# Altium project ZynQ-Feather r0.2.PrjPCB (part 2 of 2)

## Sheet 10_DDR3 RAM.SchDoc
size A3; SheetNumber: 10; SheetTotal: 14
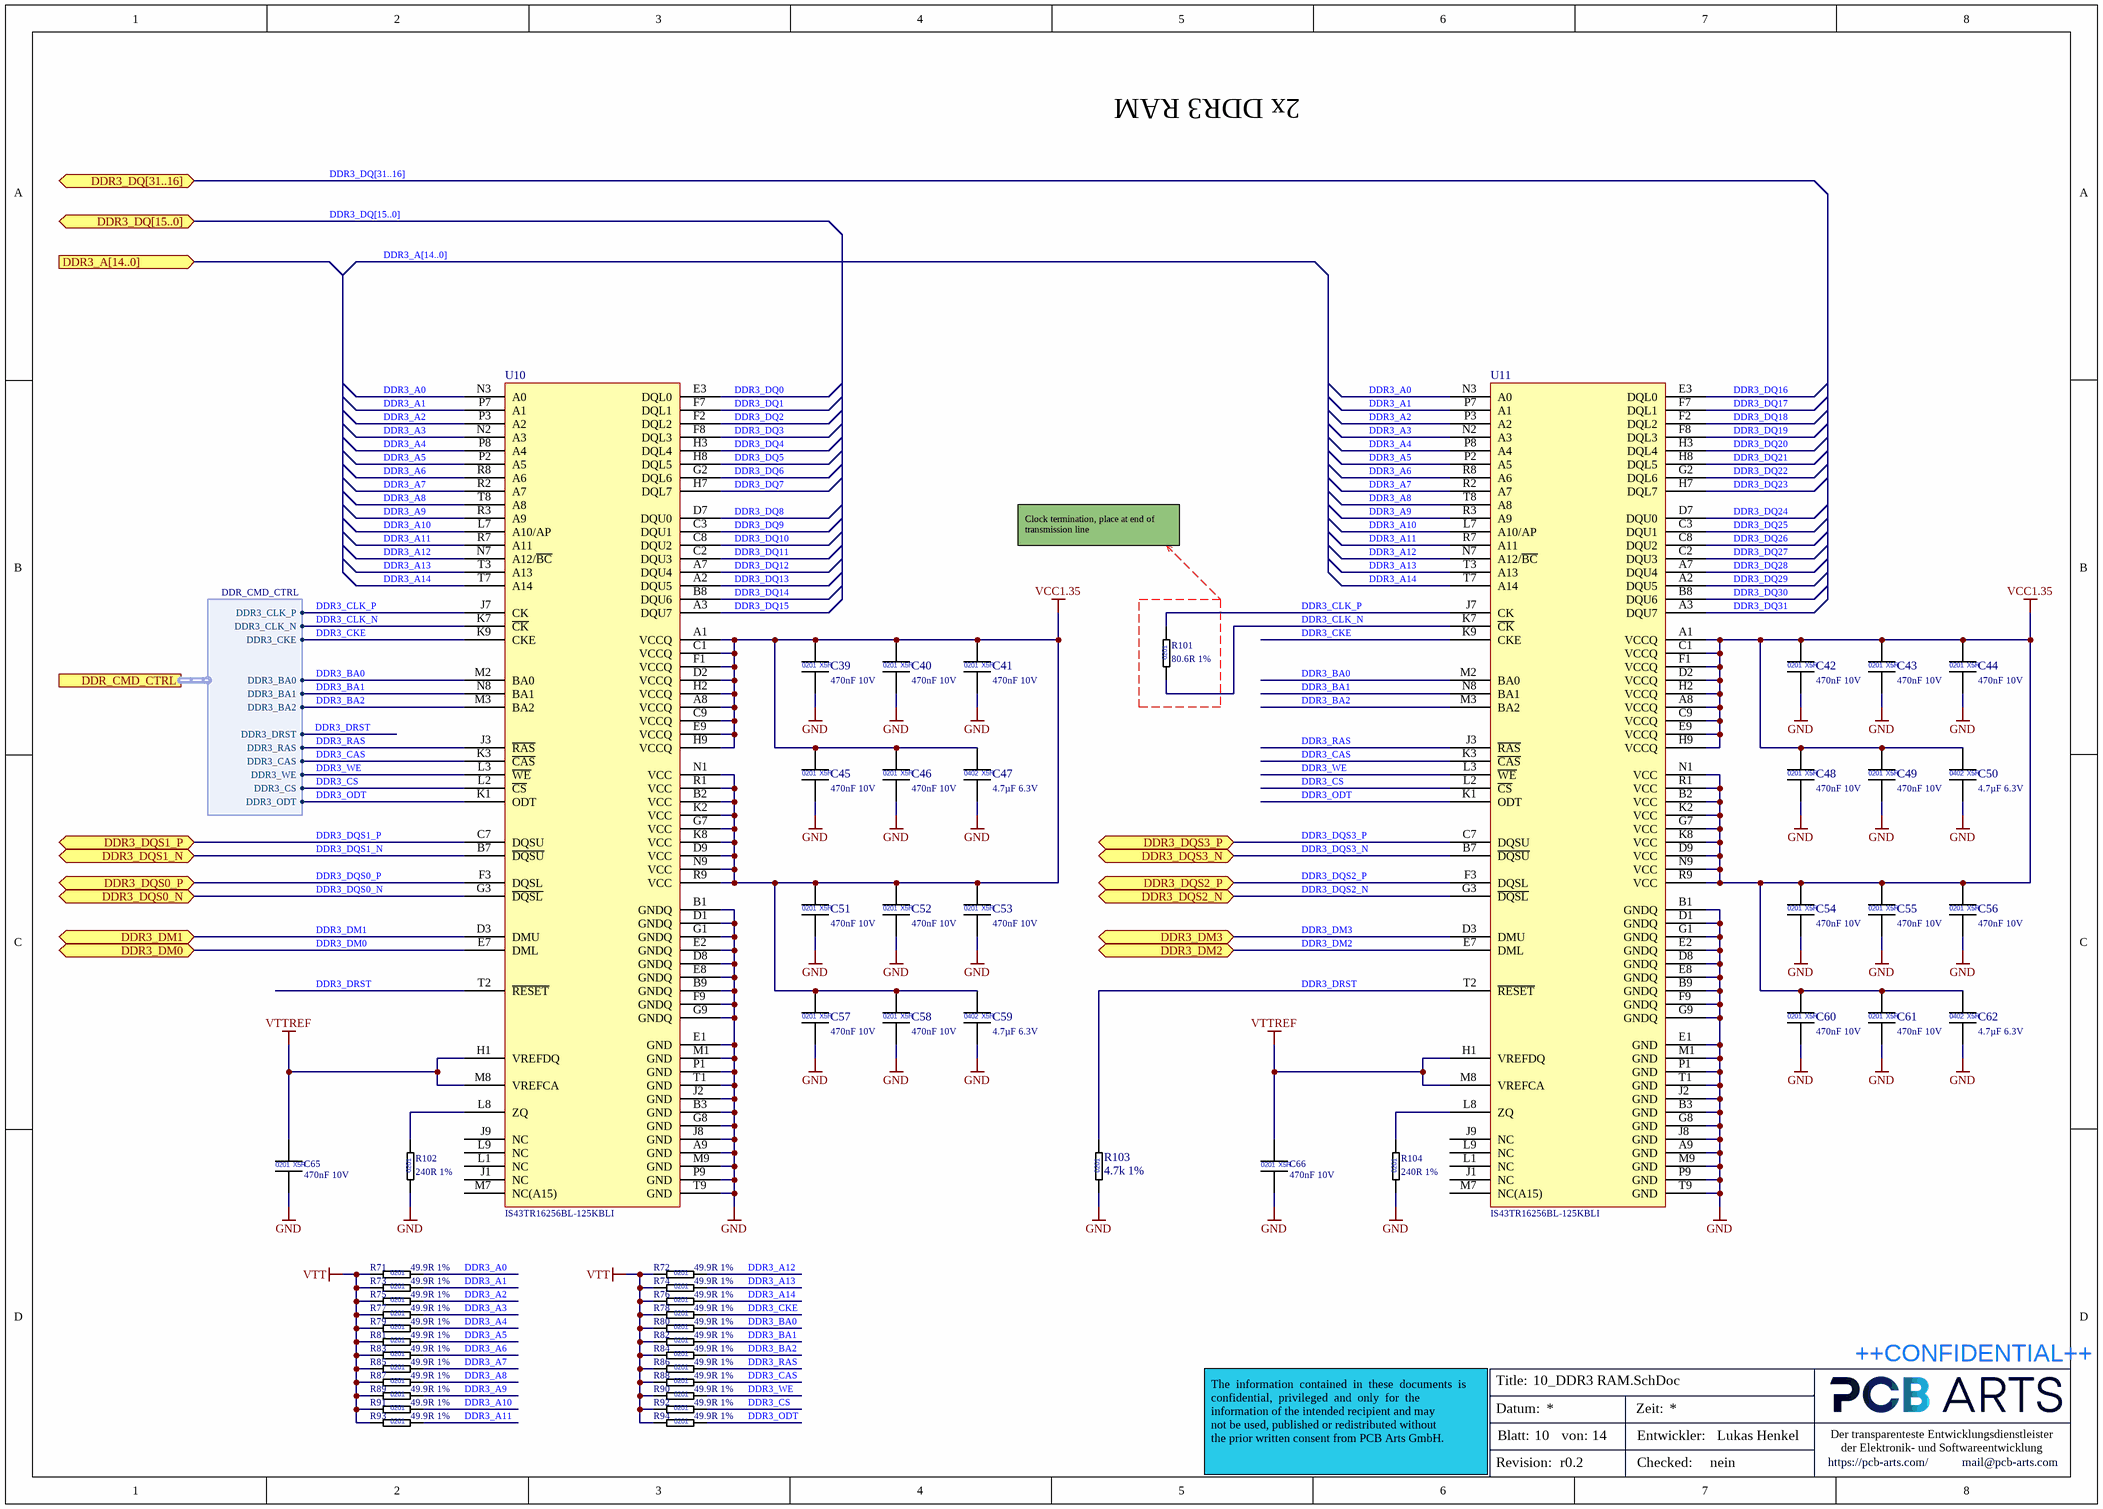
[diagram p10: 10_DDR3 RAM.SchDoc]

### Parts
C39  470nF 10V  [CAPC0603X03L]
C40  470nF 10V  [CAPC0603X03L]
C41  470nF 10V  [CAPC0603X03L]
C42  470nF 10V  [CAPC0603X03L]
C43  470nF 10V  [CAPC0603X03L]
C44  470nF 10V  [CAPC0603X03L]
C45  470nF 10V  [CAPC0603X03L]
C46  470nF 10V  [CAPC0603X03L]
C47  4.7µF 6.3V  [CAPC1005X06L]
C48  470nF 10V  [CAPC0603X03L]
C49  470nF 10V  [CAPC0603X03L]
C50  4.7µF 6.3V  [CAPC1005X06L]
C51  470nF 10V  [CAPC0603X03L]
C52  470nF 10V  [CAPC0603X03L]
C53  470nF 10V  [CAPC0603X03L]
C54  470nF 10V  [CAPC0603X03L]
C55  470nF 10V  [CAPC0603X03L]
C56  470nF 10V  [CAPC0603X03L]
C57  470nF 10V  [CAPC0603X03L]
C58  470nF 10V  [CAPC0603X03L]
C59  4.7µF 6.3V  [CAPC1005X06L]
C60  470nF 10V  [CAPC0603X03L]
C61  470nF 10V  [CAPC0603X03L]
C62  4.7µF 6.3V  [CAPC1005X06L]
C65  470nF 10V  [CAPC0603X03L]
C66  470nF 10V  [CAPC0603X03L]
R71  49.9R 1%  [RESC0603X03L]
R72  49.9R 1%  [RESC0603X03L]
R73  49.9R 1%  [RESC0603X03L]
R74  49.9R 1%  [RESC0603X03L]
R75  49.9R 1%  [RESC0603X03L]
R76  49.9R 1%  [RESC0603X03L]
R77  49.9R 1%  [RESC0603X03L]
R78  49.9R 1%  [RESC0603X03L]
R79  49.9R 1%  [RESC0603X03L]
R80  49.9R 1%  [RESC0603X03L]
R81  49.9R 1%  [RESC0603X03L]
R82  49.9R 1%  [RESC0603X03L]
R83  49.9R 1%  [RESC0603X03L]
R84  49.9R 1%  [RESC0603X03L]
R85  49.9R 1%  [RESC0603X03L]
R86  49.9R 1%  [RESC0603X03L]
R87  49.9R 1%  [RESC0603X03L]
R88  49.9R 1%  [RESC0603X03L]
R89  49.9R 1%  [RESC0603X03L]
R90  49.9R 1%  [RESC0603X03L]
R91  49.9R 1%  [RESC0603X03L]
R92  49.9R 1%  [RESC0603X03L]
R93  49.9R 1%  [RESC0603X03L]
R94  49.9R 1%  [RESC0603X03L]
R101  80.6R 1%  [RESC0603X03L]
R102  240R 1%  [RESC0603X03L]
R103  4.7k 1%  [RESC0603X03L]
R104  240R 1%  [RESC0603X03L]
U10  IS43TR16256BL-125KBLI  [BGA96C80P9X16_900X1300X120]
U11  IS43TR16256BL-125KBLI  [BGA96C80P9X16_900X1300X120]

### Ports
DDR3_A[14..0] (in), DDR3_DM0 (bidir), DDR3_DM1 (bidir), DDR3_DM2 (bidir), DDR3_DM3 (bidir), DDR3_DQ[15..0] (bidir), DDR3_DQ[31..16] (bidir), DDR3_DQS0_N (bidir), DDR3_DQS0_P (bidir), DDR3_DQS1_N (bidir), DDR3_DQS1_P (bidir), DDR3_DQS2_N (bidir), DDR3_DQS2_P (bidir), DDR3_DQS3_N (bidir), DDR3_DQS3_P (bidir), DDR_CMD_CTRL (harness DDR_CMD_CTRL)

### Harnesses
DDR_CMD_CTRL: DDR3_CLK_P, DDR3_CLK_N, DDR3_CKE, DDR3_BA0, DDR3_BA1, DDR3_RAS, DDR3_CS, DDR3_WE, DDR3_CAS, DDR3_BA2, DDR3_ODT, DDR3_DRST

### Nets
GND: C39.2 C40.2 C41.2 C42.2 C43.2 C44.2 C45.2 C46.2 C47.2 C48.2 C49.2 C50.2 C51.2 C52.2 C53.2 C54.2 C55.2 C56.2 C57.2 C58.2 C59.2 C60.2 C61.2 C62.2 C65.2 C66.2 R102.1 R103.1 R104.1 U10.A9(GND) U10.B1(GNDQ) U10.B3(GND) U10.B9(GNDQ) U10.D1(GNDQ) U10.D8(GNDQ) U10.E1(GND) U10.E2(GNDQ) U10.E8(GNDQ) U10.F9(GNDQ) U10.G1(GNDQ) U10.G8(GND) U10.G9(GNDQ) U10.J2(GND) U10.J8(GND) U10.M1(GND) U10.M9(GND) U10.P1(GND) U10.P9(GND) U10.T1(GND) U10.T9(GND) U11.A9(GND) U11.B1(GNDQ) U11.B3(GND) U11.B9(GNDQ) U11.D1(GNDQ) U11.D8(GNDQ) U11.E1(GND) U11.E2(GNDQ) U11.E8(GNDQ) U11.F9(GNDQ) U11.G1(GNDQ) U11.G8(GND) U11.G9(GNDQ) U11.J2(GND) U11.J8(GND) U11.M1(GND) U11.M9(GND) U11.P1(GND) U11.P9(GND) U11.T1(GND) U11.T9(GND)
VCC1.35: C39.1 C40.1 C41.1 C42.1 C43.1 C44.1 C45.1 C46.1 C47.1 C48.1 C49.1 C50.1 C51.1 C52.1 C53.1 C54.1 C55.1 C56.1 C57.1 C58.1 C59.1 C60.1 C61.1 C62.1 U10.A1(VCCQ) U10.A8(VCCQ) U10.B2(VCC) U10.C1(VCCQ) U10.C9(VCCQ) U10.D2(VCCQ) U10.D9(VCC) U10.E9(VCCQ) U10.F1(VCCQ) U10.G7(VCC) U10.H2(VCCQ) U10.H9(VCCQ) U10.K2(VCC) U10.K8(VCC) U10.N1(VCC) U10.N9(VCC) U10.R1(VCC) U10.R9(VCC) U11.A1(VCCQ) U11.A8(VCCQ) U11.B2(VCC) U11.C1(VCCQ) U11.C9(VCCQ) U11.D2(VCCQ) U11.D9(VCC) U11.E9(VCCQ) U11.F1(VCCQ) U11.G7(VCC) U11.H2(VCCQ) U11.H9(VCCQ) U11.K2(VCC) U11.K8(VCC) U11.N1(VCC) U11.N9(VCC) U11.R1(VCC) U11.R9(VCC)
VTT: R71.1 R72.1 R73.1 R74.1 R75.1 R76.1 R77.1 R78.1 R79.1 R80.1 R81.1 R82.1 R83.1 R84.1 R85.1 R86.1 R87.1 R88.1 R89.1 R90.1 R91.1 R92.1 R93.1 R94.1
VTTREF: C65.1 C66.1 U10.H1(VREFDQ) U10.M8(VREFCA) U11.H1(VREFDQ) U11.M8(VREFCA)
DDR3_A0: R71.2 U10.N3(A0) U11.N3(A0)
DDR3_A1: R73.2 U10.P7(A1) U11.P7(A1)
DDR3_A2: R75.2 U10.P3(A2) U11.P3(A2)
DDR3_A3: R77.2 U10.N2(A3) U11.N2(A3)
DDR3_A4: R79.2 U10.P8(A4) U11.P8(A4)
DDR3_A5: R81.2 U10.P2(A5) U11.P2(A5)
DDR3_A6: R83.2 U10.R8(A6) U11.R8(A6)
DDR3_A7: R85.2 U10.R2(A7) U11.R2(A7)
DDR3_A8: R87.2 U10.T8(A8) U11.T8(A8)
DDR3_A9: R89.2 U10.R3(A9) U11.R3(A9)
DDR3_A10: R91.2 U10.L7(A10/AP) U11.L7(A10/AP)
DDR3_A11: R93.2 U10.R7(A11) U11.R7(A11)
DDR3_A12: R72.2 U10.N7(A12/~{BC}) U11.N7(A12/~{BC})
DDR3_A13: R74.2 U10.T3(A13) U11.T3(A13)
DDR3_A14: R76.2 U10.T7(A14) U11.T7(A14)
DDR3_BA0: R80.2 U10.M2(BA0) U11.M2(BA0) ; port DDR_CMD_CTRL.DDR3_BA0
DDR3_BA1: R82.2 U10.N8(BA1) U11.N8(BA1) ; port DDR_CMD_CTRL.DDR3_BA1
DDR3_BA2: R84.2 U10.M3(BA2) U11.M3(BA2) ; port DDR_CMD_CTRL.DDR3_BA2
DDR3_CAS: R88.2 U10.K3(~{CAS}) U11.K3(~{CAS}) ; port DDR_CMD_CTRL.DDR3_CAS
DDR3_CKE: R78.2 U10.K9(CKE) U11.K9(CKE) ; port DDR_CMD_CTRL.DDR3_CKE
DDR3_CLK_N: R101.1 U10.K7(~{CK}) U11.K7(~{CK}) ; port DDR_CMD_CTRL.DDR3_CLK_N
DDR3_CLK_P: R101.2 U10.J7(CK) U11.J7(CK) ; port DDR_CMD_CTRL.DDR3_CLK_P
DDR3_CS: R92.2 U10.L2(~{CS}) U11.L2(~{CS}) ; port DDR_CMD_CTRL.DDR3_CS
DDR3_DM0: U10.E7(DML) ; port DDR3_DM0
DDR3_DM1: U10.D3(DMU) ; port DDR3_DM1
DDR3_DM2: U11.E7(DML) ; port DDR3_DM2
DDR3_DM3: U11.D3(DMU) ; port DDR3_DM3
DDR3_DQ0: U10.E3(DQL0)
DDR3_DQ1: U10.F7(DQL1)
DDR3_DQ2: U10.F2(DQL2)
DDR3_DQ3: U10.F8(DQL3)
DDR3_DQ4: U10.H3(DQL4)
DDR3_DQ5: U10.H8(DQL5)
DDR3_DQ6: U10.G2(DQL6)
DDR3_DQ7: U10.H7(DQL7)
DDR3_DQ8: U10.D7(DQU0)
DDR3_DQ9: U10.C3(DQU1)
DDR3_DQ10: U10.C8(DQU2)
DDR3_DQ11: U10.C2(DQU3)
DDR3_DQ12: U10.A7(DQU4)
DDR3_DQ13: U10.A2(DQU5)
DDR3_DQ14: U10.B8(DQU6)
DDR3_DQ15: U10.A3(DQU7)
DDR3_DQ16: U11.E3(DQL0)
DDR3_DQ17: U11.F7(DQL1)
DDR3_DQ18: U11.F2(DQL2)
DDR3_DQ19: U11.F8(DQL3)
DDR3_DQ20: U11.H3(DQL4)
DDR3_DQ21: U11.H8(DQL5)
DDR3_DQ22: U11.G2(DQL6)
DDR3_DQ23: U11.H7(DQL7)
DDR3_DQ24: U11.D7(DQU0)
DDR3_DQ25: U11.C3(DQU1)
DDR3_DQ26: U11.C8(DQU2)
DDR3_DQ27: U11.C2(DQU3)
DDR3_DQ28: U11.A7(DQU4)
DDR3_DQ29: U11.A2(DQU5)
DDR3_DQ30: U11.B8(DQU6)
DDR3_DQ31: U11.A3(DQU7)
DDR3_DQS0_N: U10.G3(~{DQSL}) ; port DDR3_DQS0_N
DDR3_DQS0_P: U10.F3(DQSL) ; port DDR3_DQS0_P
DDR3_DQS1_N: U10.B7(~{DQSU}) ; port DDR3_DQS1_N
DDR3_DQS1_P: U10.C7(DQSU) ; port DDR3_DQS1_P
DDR3_DQS2_N: U11.G3(~{DQSL}) ; port DDR3_DQS2_N
DDR3_DQS2_P: U11.F3(DQSL) ; port DDR3_DQS2_P
DDR3_DQS3_N: U11.B7(~{DQSU}) ; port DDR3_DQS3_N
DDR3_DQS3_P: U11.C7(DQSU) ; port DDR3_DQS3_P
DDR3_DRST: R103.2 U10.T2(~{RESET}) U11.T2(~{RESET}) ; port DDR_CMD_CTRL.DDR3_DRST
DDR3_ODT: R94.2 U10.K1(ODT) U11.K1(ODT) ; port DDR_CMD_CTRL.DDR3_ODT
DDR3_RAS: R86.2 U10.J3(~{RAS}) U11.J3(~{RAS}) ; port DDR_CMD_CTRL.DDR3_RAS
DDR3_WE: R90.2 U10.L3(~{WE}) U11.L3(~{WE}) ; port DDR_CMD_CTRL.DDR3_WE
NetR102_2: R102.2 U10.L8(ZQ)
NetR104_2: R104.2 U11.L8(ZQ)

Not connected (* = marked no-connect by the designer): U10 J1(NC) J9(NC) L1(NC) L9(NC) M7(NC(A15)); U11 J1(NC) J9(NC) L1(NC) L9(NC) M7(NC(A15))

### Buses and harness runs
bus DDR3_A[14..0] = port DDR3_A[14..0]
bus DDR3_DQ[15..0] = port DDR3_DQ[15..0]
bus DDR3_DQ[31..16] = port DDR3_DQ[31..16]

### Notes on the sheet
- 2x DDR3 RAM
- Clock termination, place at end of transmission line
- Title:
- ++CONFIDENTIAL++
- Datum:
- Blatt:
- von:
- Zeit:
- Entwickler:
- Der transparenteste Entwicklungsdienstleister
  der Elektronik- und Softwareentwicklung
- The  information  contained  in  these  documents  is  confidential,  privileged  and  only  for  the
  information of the intended recipient and may
  not be used, published or redistributed without
  the prior written consent from PCB Arts GmbH.
- Revision:
- Checked:
- https://pcb-arts.com/
- mail@pcb-arts.com
- (in symbol CAP_0201_470nF_10V) 0201; X5R
- (in symbol CAP_0402_4.7µ_6.3V) 0402; X5R
- (in symbol RES_0201_4.7k_1%) 0201
- (in symbol RES_0201_49.9R_1%) 0201
- (in symbol RES_0201_80.6R_1%) 0201
- (in symbol RES_0201_240R_1%) 0201

### Library data of the parts
C39-C46 C48 C49 C51-C58 C60 C61 C65 C66 = CAP_0201_470nF_10V: Multilayer Ceramic Capacitors MLCC - SMD/SMT 0201 10VDC; Manufacturer 1: Taiyo Yuden; Manufacturer 1 Prt. Nr.: LMK063BBJ474KPLF; Manufacturer 2 Prt. Nr.: C0603X5R1A474M030BC; Manufacturer 2: TDK
C47 C50 C59 C62 = CAP_0402_4.7µ_6.3V: Multilayer Ceramic Capacitors MLCC - SMD/SMT 0402 6.3VDC; Manufacturer 1: Murata Electronics; Manufacturer 1 Prt. Nr.: GRM155R60J475ME47D; Manufacturer 2 Prt. Nr.: JMK105BC6475MV-F; Manufacturer 2: Taiyo Yuden
R71-R94 = RES_0201_49.9R_1%: Thick Film Resistors - SMD 49.9R OHM 1%; Manufacturer 1: Yageo; Manufacturer 1 Prt. Nr.: AC0201FR-0749R9L; Manufacturer 2 Prt. Nr.: CRCW020149R9FNED; Manufacturer 2: Vishay / Dale
R101 = RES_0201_80.6R_1%: Thick Film Resistors - SMD 80.6R OHM 1%; Manufacturer 1: Yageo; Manufacturer 1 Prt. Nr.: RC0201FR-0780R6L; Manufacturer 2 Prt. Nr.: CRCW020180R6FKED; Manufacturer 2: Vishay / Dale
R102 R104 = RES_0201_240R_1%: Thick Film Resistors - SMD 240 OHM 1%; Manufacturer 1: Yageo; Manufacturer 1 Prt. Nr.: RC0201FR-07240RL; Manufacturer 2 Prt. Nr.: CRCW0201240RFNED; Manufacturer 2: Vishay / Dale
R103 = RES_0201_4.7k_1%: Thick Film Resistors - SMD 4.7K OHM 1%; Manufacturer 1: Yageo; Manufacturer 1 Prt. Nr.: RC0201JR-074K7P; Manufacturer 2 Prt. Nr.: CRCW02014K70FNED; Manufacturer 2: Vishay / Dale
U10 U11 = IS43TR16256BL-125KBLI_DRAM 4G, 1.35V, DDR3L, 256Mx16: DRAM 4G, 1.35V, DDR3L, 256Mx16, 1600MT/s @ 11-11-11, 96 ball BGA (9mm x13mm) RoHS, IT; Manufacturer 1: ISSI; Manufacturer 1 Prt. Nr.: IS43TR16256BL-125KBLI

## Sheet 12_QSPI SD-Card.SchDoc
size A4; SheetNumber: 12; SheetTotal: 14
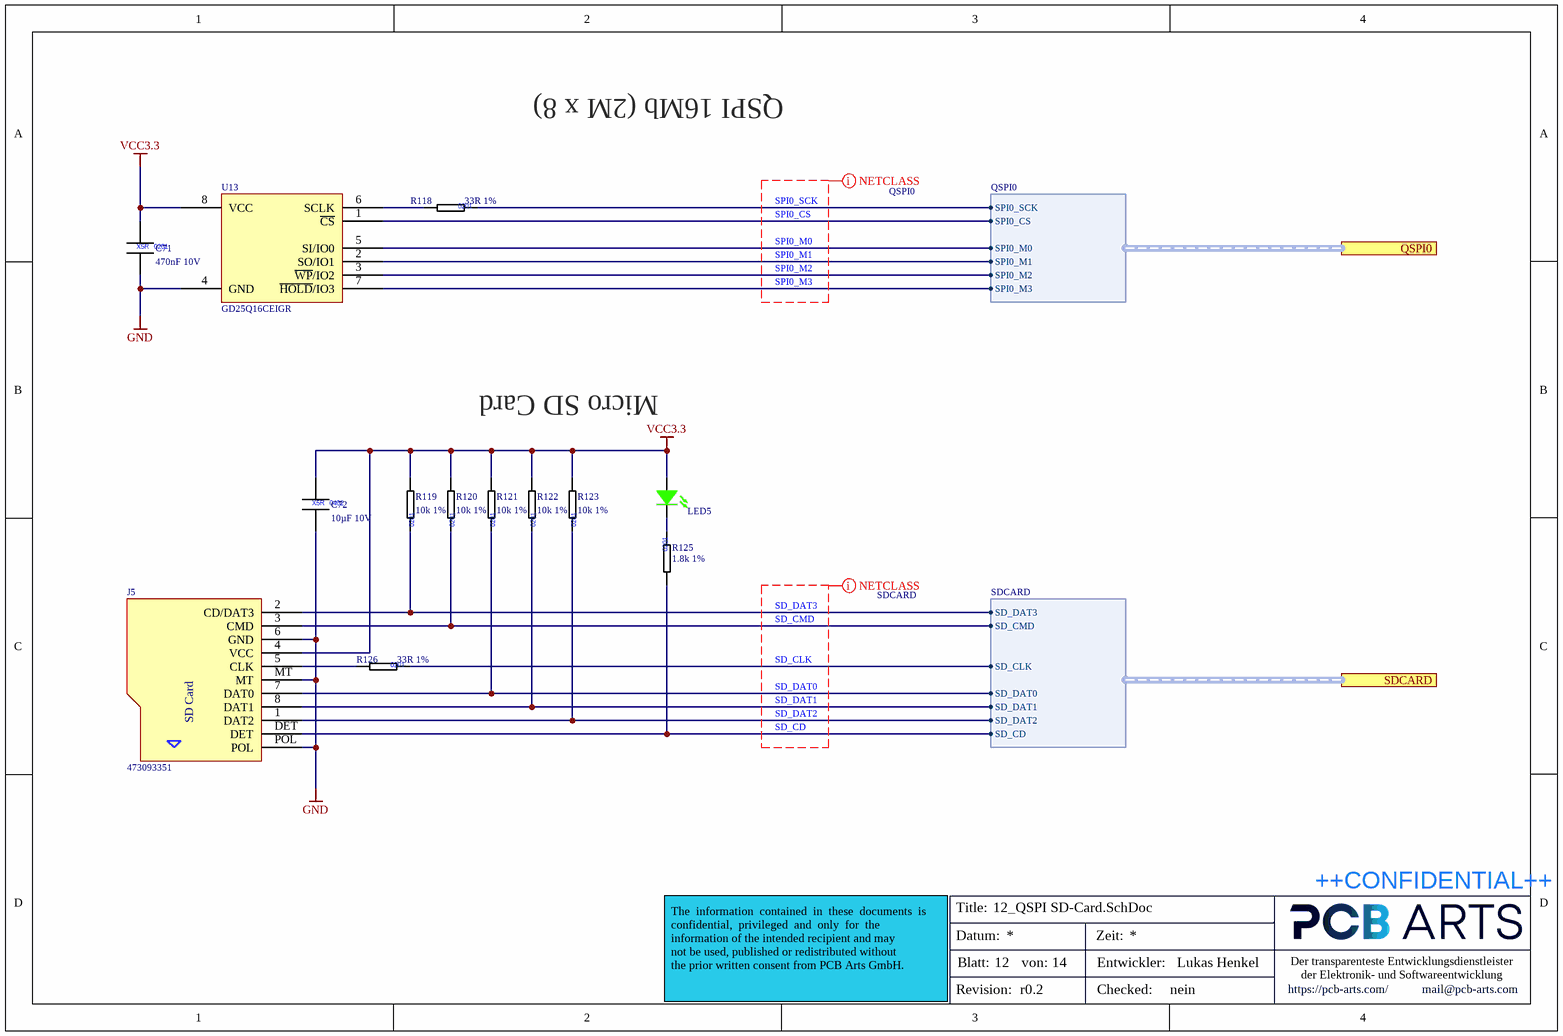
[diagram p11: 12_QSPI SD-Card.SchDoc]

### Parts
C71  470nF 10V  [CAPC0603X03L]
C72  10µF 10V  [CAPC1005X06L]
J5  473093351  [47309-3351]
LED5  150040GS73220  [WL-SMCC_0402_H=0.25mm]  (value not drawn)
R118  33R 1%  [RESC0603X03L]
R119  10k 1%  [RESC0603X03L]
R120  10k 1%  [RESC0603X03L]
R121  10k 1%  [RESC0603X03L]
R122  10k 1%  [RESC0603X03L]
R123  10k 1%  [RESC0603X03L]
R125  1.8k 1%  [RESC0603X03L]
R126  33R 1%  [RESC0603X03L]
U13  GD25Q16CEIGR  [PSON50P300X50_HS-9N]

### Ports
QSPI0 (harness QSPI0), SDCARD (harness SDCARD)

### Harnesses
QSPI0: SPI0_SCK, SPI0_CS, SPI0_M0, SPI0_M1, SPI0_M2, SPI0_M3
SDCARD: SD_DAT3, SD_CMD, SD_CLK, SD_DAT0, SD_DAT1, SD_DAT2, SD_CD

### Nets
GND: C71.2 C72.2 J5.6(GND) J5.MT J5.POL U13.4(GND)
VCC3.3: C71.1 C72.1 J5.4(VCC) LED5.2 R119.2 R120.2 R121.2 R122.2 R123.2 U13.8(VCC)
SD_CD: J5.DET R125.2 ; port SDCARD.SD_CD
SD_CLK: R126.1 ; port SDCARD.SD_CLK
SD_CMD: J5.3(CMD) R120.1 ; port SDCARD.SD_CMD
SD_DAT0: J5.7(DAT0) R121.1 ; port SDCARD.SD_DAT0
SD_DAT1: J5.8(DAT1) R122.1 ; port SDCARD.SD_DAT1
SD_DAT2: J5.1(DAT2) R123.1 ; port SDCARD.SD_DAT2
SD_DAT3: J5.2(CD/DAT3) R119.1 ; port SDCARD.SD_DAT3
SPI0_CS: U13.1(~{CS}) ; port QSPI0.SPI0_CS
SPI0_M0: U13.5(SI/IO0) ; port QSPI0.SPI0_M0
SPI0_M1: U13.2(SO/IO1) ; port QSPI0.SPI0_M1
SPI0_M2: U13.3(~{WP}/IO2) ; port QSPI0.SPI0_M2
SPI0_M3: U13.7(~{HOLD}/IO3) ; port QSPI0.SPI0_M3
SPI0_SCK: R118.1 ; port QSPI0.SPI0_SCK
NetJ5_5: J5.5(CLK) R126.2
NetLED5_1: LED5.1 R125.1
NetR118_2: R118.2 U13.6(SCLK)

### Layout directives
net class QSPI0: SPI0_CS, SPI0_M0, SPI0_M1, SPI0_M2, SPI0_M3, SPI0_SCK
net class SDCARD: SD_CD, SD_CLK, SD_CMD, SD_DAT0, SD_DAT1, SD_DAT2, SD_DAT3

### Notes on the sheet
- QSPI 16Mb (2M x 8)
- Micro SD Card
- Title:
- ++CONFIDENTIAL++
- Datum:
- Blatt:
- von:
- Zeit:
- Entwickler:
- Der transparenteste Entwicklungsdienstleister
  der Elektronik- und Softwareentwicklung
- The  information  contained  in  these  documents  is  confidential,  privileged  and  only  for  the
  information of the intended recipient and may
  not be used, published or redistributed without
  the prior written consent from PCB Arts GmbH.
- Revision:
- Checked:
- https://pcb-arts.com/
- mail@pcb-arts.com
- (in symbol 473093351_1.10mm Pitch microSD Card Header) SD Card
- (in symbol CAP_0201_470nF_10V) X5R; 0201
- (in symbol CAP_0402_10µ_10V) X5R; 0402
- (in symbol RES_0201_1.8k_1%) 0201
- (in symbol RES_0201_10k_1%) 0201
- (in symbol RES_0201_33R_1%) 0201

### Library data of the parts
C71 = CAP_0201_470nF_10V: as C39-C46 on sheet 10_DDR3 RAM; Manufacturer 2: TDK
C72 = CAP_0402_10µ_10V: Multilayer Ceramic Capacitors MLCC - SMD/SMT 0402 10VDC; Manufacturer 1: Murata Electronics; Manufacturer 1 Prt. Nr.: GRM155R61A475MEAAD; Manufacturer 2 Prt. Nr.: LMK105BBJ475MVLF; Manufacturer 2: Taiyo Yuden
J5 = 473093351_1.10mm Pitch microSD Card Header: 1.10mm Pitch microSD Card Header with Detect Switch, Height 3.35mm, Lead-Free; Manufacturer 1: Molex; ComponentLink1 Description: Manufacturer; ComponentLink2 Description: Datasheet; ComponentLink1URL: http://www.we-online.de; ComponentLink2URL: http://katalog.we-online.de/em/datasheet/693063020911.pdf; Manufacturer 1 Prt. Nr.: 473093351
LED5 = 150040GS73220_SMD WL-SMCC SMT LED Mono-color: Standard LEDs - SMD WL-SMCC SMT LED Mono-color; Manufacturer 1: Wurth Elektronik; Manufacturer 1 Prt. Nr.: 150040GS73220
R118 R126 = RES_0201_33R_1%: Thick Film Resistors - SMD 33R OHM 1%; Manufacturer 1: Yageo; Manufacturer 1 Prt. Nr.: RC0201FR-0733RL; Manufacturer 2 Prt. Nr.: CRCW020133R0FNED; Manufacturer 2: Vishay / Dale
R119-R123 = RES_0201_10k_1%: Thick Film Resistors - SMD 10K OHM 1%; Manufacturer 1: Yageo; Manufacturer 1 Prt. Nr.: RC0201FR-0710KL; Manufacturer 2 Prt. Nr.: CRCW020110K0FNED; Manufacturer 2: Vishay / Dale
R125 = RES_0201_1.8k_1%: Thick Film Resistors - SMD 1.8K OHM 1%; Manufacturer 1: Panasonic; Manufacturer 1 Prt. Nr.: ERJ-1GNF1801C; Manufacturer 2 Prt. Nr.: CRCW02011K80FKED; Manufacturer 2: Vishay / Dale
U13 = GD25Q16CEIGR_NOR Flash 16Mbit: NOR Flash 16Mbit NOR Flash /3.3V /WSON 3*2*0.45mm /Industrial(-40 to +85 ) /T&R; Manufacturer 1: GigaDevice; Manufacturer 1 Prt. Nr.: GD25Q16CEIGR

## Sheet 11_Zynq MIO.SchDoc
size A3; SheetNumber: 11; SheetTotal: 14
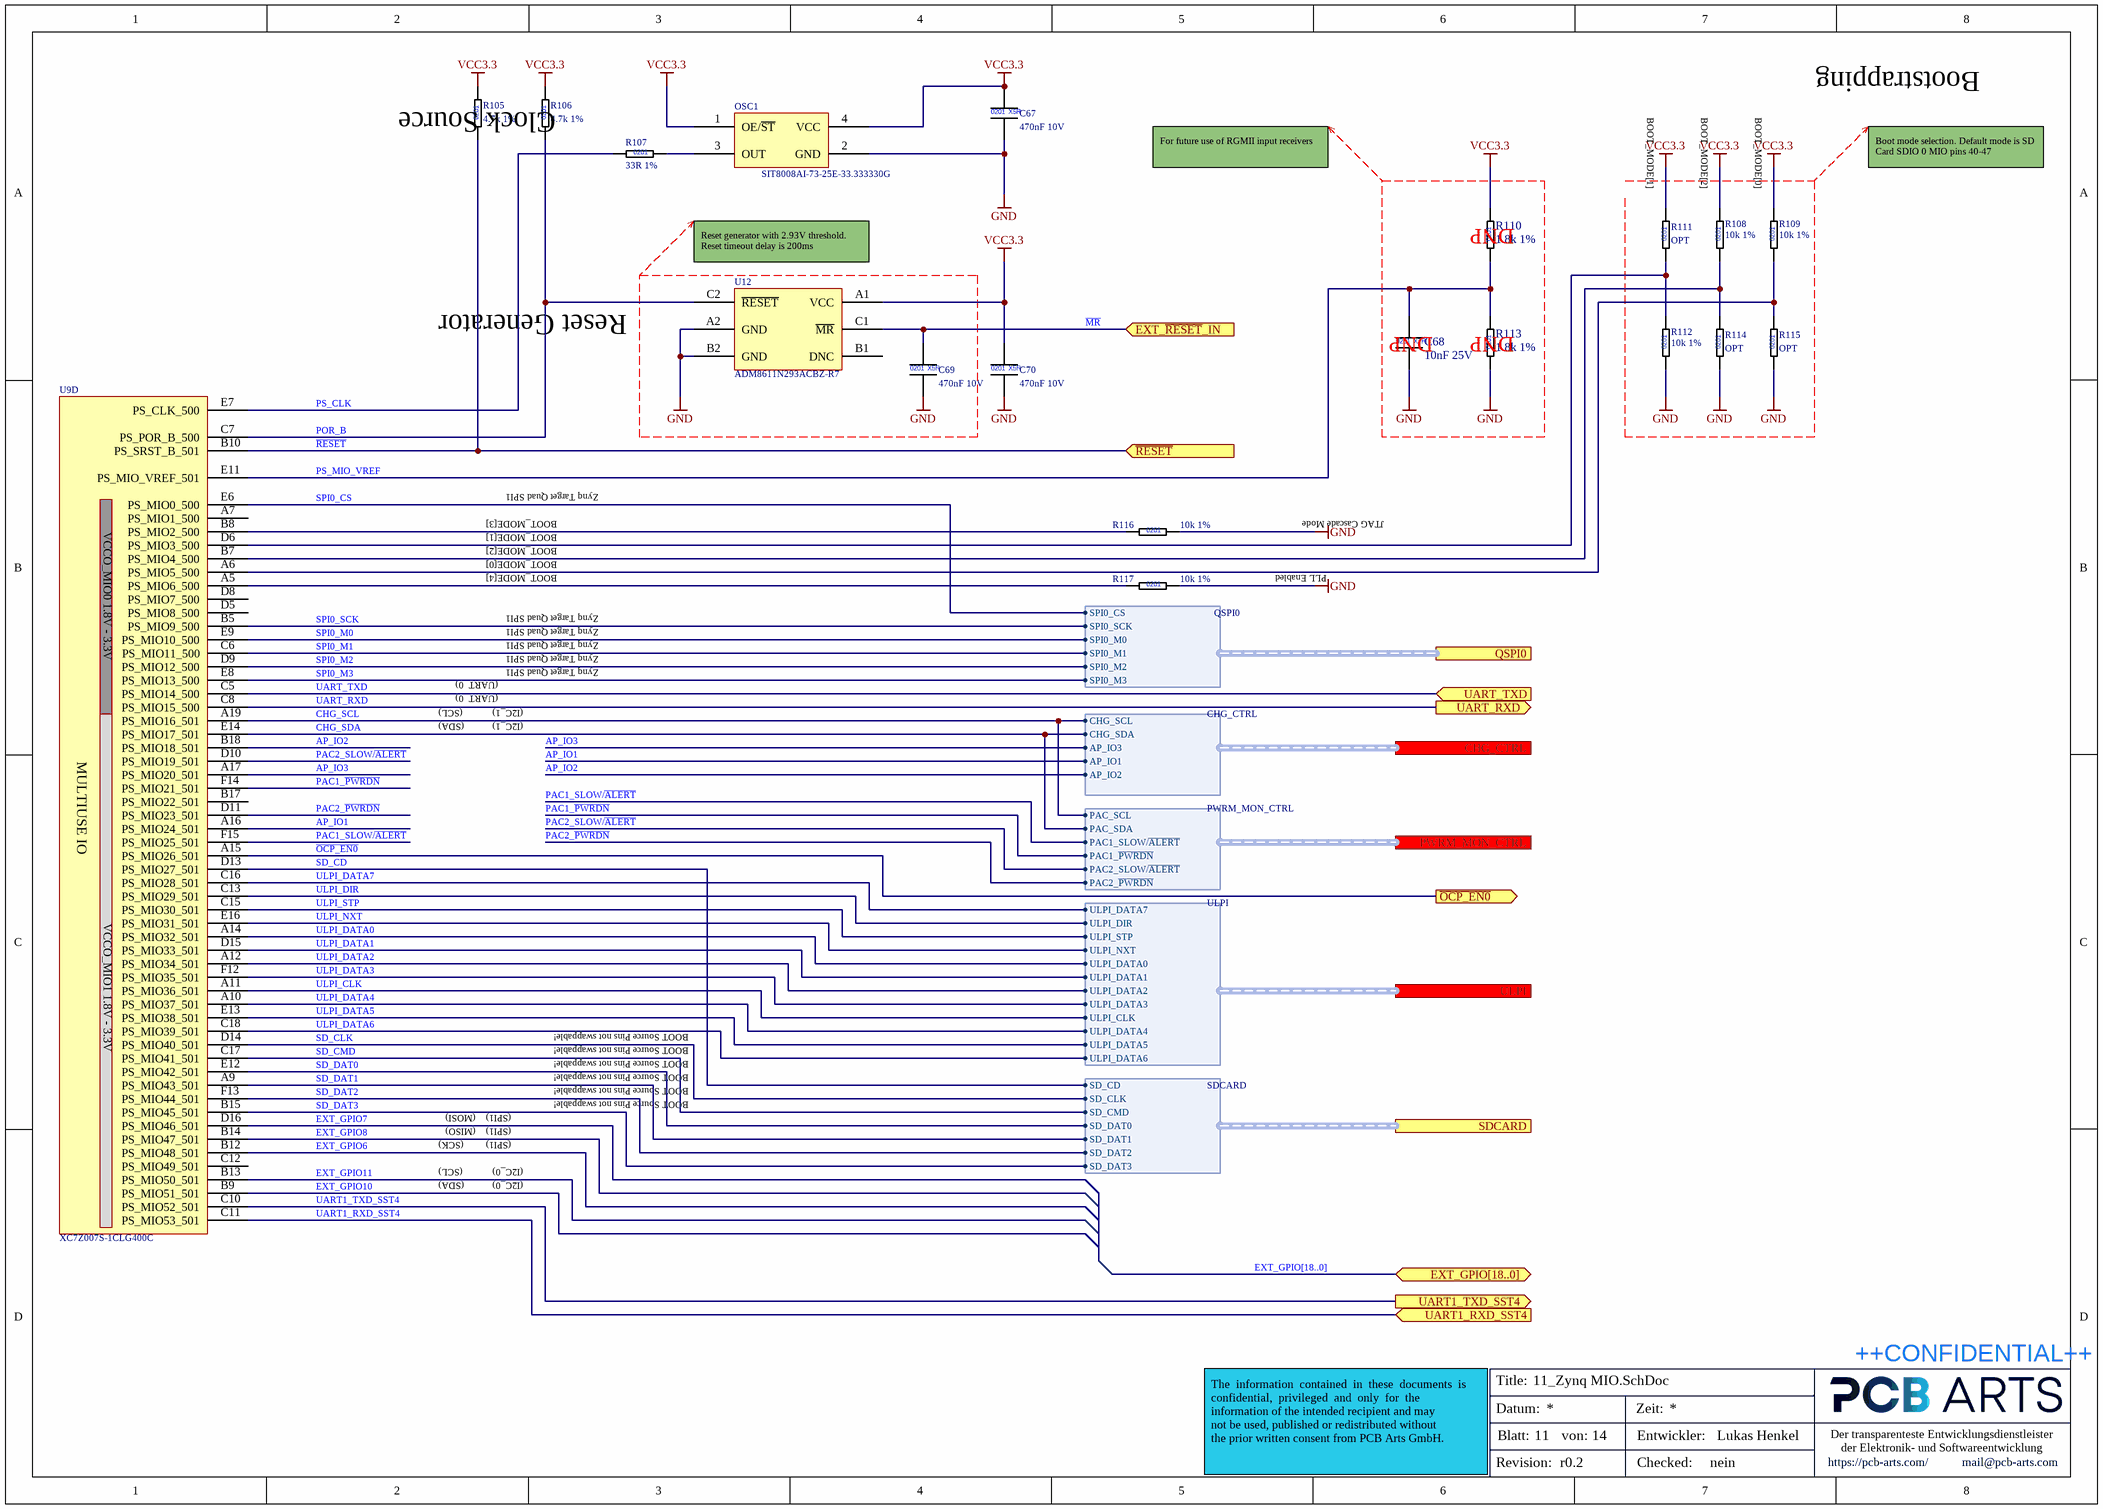
[diagram p12: 11_Zynq MIO.SchDoc]

### Parts
C67  470nF 10V  [CAPC0603X03L]
C68  10nF 25V  [CAPC0603X03L]
C69  470nF 10V  [CAPC0603X03L]
C70  470nF 10V  [CAPC0603X03L]
OSC1  SIT8008AI-73-25E-33.333330G  [SiT8008]
R105  4.7k 1%  [RESC0603X03L]
R106  4.7k 1%  [RESC0603X03L]
R107  33R 1%  [RESC0603X03L]
R108  10k 1%  [RESC0603X03L]
R109  10k 1%  [RESC0603X03L]
R110  1.8k 1%  [RESC0603X03L]
R111  OPT  [RESC0603X03L]  (no BOM)
R112  10k 1%  [RESC0603X03L]
R113  1.8k 1%  [RESC0603X03L]
R114  OPT  [RESC0603X03L]  (no BOM)
R115  OPT  [RESC0603X03L]  (no BOM)
R116  10k 1%  [RESC0603X03L]
R117  10k 1%  [RESC0603X03L]
U9  XC7Z007S-1CLG400C  [BGA400C80P20X20_1700X1700X160]  (part D of 8)
U12  ADM8611N293ACBZ-R7  [BGA6C50P2X3_96X146X66]

### Ports
CHG_CTRL (harness CHG_CTRL), EXT_GPIO[18..0] (bidir), EXT_~{RESET}_IN (in), PWRM_MON_CTRL (harness PWRM_MON_CTRL), QSPI0 (harness QSPI0), SDCARD (harness SDCARD), UART1_RXD_SST4 (in), UART1_TXD_SST4 (out), UART_RXD (out), UART_TXD (in), ULPI (harness ULPI), ~{OCP_EN0} (out), ~{RESET} (in)

### Harnesses
CHG_CTRL: CHG_SDA, CHG_SCL, AP_IO1, AP_IO2, AP_IO3
PWRM_MON_CTRL: PAC1_SLOW/~{ALERT}, PAC_SCL, PAC1_~{PWRDN}, PAC_SDA, PAC2_SLOW/~{ALERT}, PAC2_~{PWRDN}
QSPI0: SPI0_SCK, SPI0_CS, SPI0_M0, SPI0_M1, SPI0_M2, SPI0_M3
SDCARD: SD_DAT3, SD_CMD, SD_CLK, SD_DAT0, SD_DAT1, SD_DAT2, SD_CD
ULPI: ULPI_DATA7, ULPI_DIR, ULPI_STP, ULPI_NXT, ULPI_DATA0, ULPI_DATA1, ULPI_DATA2, ULPI_DATA3, ULPI_CLK, ULPI_DATA4, ULPI_DATA5, ULPI_DATA6

### Nets
GND: C67.2 C68.2 C69.2 C70.2 OSC1.2(GND) R112.1 R113.1 R114.1 R115.1 R116.2 R117.2 U12.A2(GND) U12.B2(GND)
VCC3.3: C67.1 C70.1 OSC1.1(OE/~{ST}) OSC1.4(VCC) R105.2 R106.2 R108.2 R109.2 R110.2 R111.2 U12.A1(VCC)
AP_IO1: U9.A16(PS_MIO24_501) ; port CHG_CTRL.AP_IO1
AP_IO2: U9.B18(PS_MIO18_501) ; port CHG_CTRL.AP_IO2
AP_IO3: U9.A17(PS_MIO20_501) ; port CHG_CTRL.AP_IO3
CHG_SCL: U9.A19(PS_MIO16_501) ; port CHG_CTRL.CHG_SCL, port PWRM_MON_CTRL.PAC_SCL
CHG_SDA: U9.E14(PS_MIO17_501) ; port CHG_CTRL.CHG_SDA, port PWRM_MON_CTRL.PAC_SDA
EXT_GPIO6: U9.B12(PS_MIO48_501)
EXT_GPIO7: U9.D16(PS_MIO46_501)
EXT_GPIO8: U9.B14(PS_MIO47_501)
EXT_GPIO10: U9.B9(PS_MIO51_501)
EXT_GPIO11: U9.B13(PS_MIO50_501)
~{MR}: C69.1 U12.C1(~{MR}) ; port EXT_~{RESET}_IN  [project net EXT_~{RESET}_IN]
~{OCP_EN0}: U9.A15(PS_MIO26_501) ; port ~{OCP_EN0}
PAC1_~{PWRDN}: U9.F14(PS_MIO21_501) ; port PWRM_MON_CTRL.PAC1_~{PWRDN}
PAC1_SLOW/~{ALERT}: U9.F15(PS_MIO25_501) ; port PWRM_MON_CTRL.PAC1_SLOW/~{ALERT}
PAC2_~{PWRDN}: U9.D11(PS_MIO23_501) ; port PWRM_MON_CTRL.PAC2_~{PWRDN}
PAC2_SLOW/~{ALERT}: U9.D10(PS_MIO19_501) ; port PWRM_MON_CTRL.PAC2_SLOW/~{ALERT}
POR_B: R106.1 U9.C7(PS_POR_B_500) U12.C2(~{RESET})
PS_CLK: R107.1 U9.E7(PS_CLK_500)
PS_MIO_VREF: C68.1 R110.1 R113.2 U9.E11(PS_MIO_VREF_501)
~{RESET}: R105.1 U9.B10(PS_SRST_B_501) ; port ~{RESET}
SD_CD: U9.D13(PS_MIO27_501) ; port SDCARD.SD_CD
SD_CLK: U9.D14(PS_MIO40_501) ; port SDCARD.SD_CLK
SD_CMD: U9.C17(PS_MIO41_501) ; port SDCARD.SD_CMD
SD_DAT0: U9.E12(PS_MIO42_501) ; port SDCARD.SD_DAT0
SD_DAT1: U9.A9(PS_MIO43_501) ; port SDCARD.SD_DAT1
SD_DAT2: U9.F13(PS_MIO44_501) ; port SDCARD.SD_DAT2
SD_DAT3: U9.B15(PS_MIO45_501) ; port SDCARD.SD_DAT3
SPI0_CS: U9.E6(PS_MIO0_500) ; port QSPI0.SPI0_CS
SPI0_M0: U9.E9(PS_MIO10_500) ; port QSPI0.SPI0_M0
SPI0_M1: U9.C6(PS_MIO11_500) ; port QSPI0.SPI0_M1
SPI0_M2: U9.D9(PS_MIO12_500) ; port QSPI0.SPI0_M2
SPI0_M3: U9.E8(PS_MIO13_500) ; port QSPI0.SPI0_M3
SPI0_SCK: U9.B5(PS_MIO9_500) ; port QSPI0.SPI0_SCK
UART1_RXD_SST4: U9.C11(PS_MIO53_501) ; port UART1_RXD_SST4
UART1_TXD_SST4: U9.C10(PS_MIO52_501) ; port UART1_TXD_SST4
UART_RXD: U9.C8(PS_MIO15_500) ; port UART_RXD
UART_TXD: U9.C5(PS_MIO14_500) ; port UART_TXD
ULPI_CLK: U9.A11(PS_MIO36_501) ; port ULPI.ULPI_CLK
ULPI_DATA0: U9.A14(PS_MIO32_501) ; port ULPI.ULPI_DATA0
ULPI_DATA1: U9.D15(PS_MIO33_501) ; port ULPI.ULPI_DATA1
ULPI_DATA2: U9.A12(PS_MIO34_501) ; port ULPI.ULPI_DATA2
ULPI_DATA3: U9.F12(PS_MIO35_501) ; port ULPI.ULPI_DATA3
ULPI_DATA4: U9.A10(PS_MIO37_501) ; port ULPI.ULPI_DATA4
ULPI_DATA5: U9.E13(PS_MIO38_501) ; port ULPI.ULPI_DATA5
ULPI_DATA6: U9.C18(PS_MIO39_501) ; port ULPI.ULPI_DATA6
ULPI_DATA7: U9.C16(PS_MIO28_501) ; port ULPI.ULPI_DATA7
ULPI_DIR: U9.C13(PS_MIO29_501) ; port ULPI.ULPI_DIR
ULPI_NXT: U9.E16(PS_MIO31_501) ; port ULPI.ULPI_NXT
ULPI_STP: U9.C15(PS_MIO30_501) ; port ULPI.ULPI_STP
NetOSC1_3: OSC1.3(OUT) R107.2
NetR108_1: R108.1 R114.2 U9.B7(PS_MIO4_500)
NetR109_1: R109.1 R115.2 U9.A6(PS_MIO5_500)
NetR111_1: R111.1 R112.2 U9.D6(PS_MIO3_500)
NetR116_1: R116.1 U9.B8(PS_MIO2_500)
NetR117_1: R117.1 U9.A5(PS_MIO6_500)

Not connected (* = marked no-connect by the designer): U9 A7(PS_MIO1_500) B17(PS_MIO22_501) C12(PS_MIO49_501) D5(PS_MIO8_500) D8(PS_MIO7_500); U12 B1(DNC)

### Buses and harness runs
bus EXT_GPIO[18..0] = port EXT_GPIO[18..0]

### Notes on the sheet
- Bootstrapping
- Clock Source
- For future use of RGMII input receivers
- Boot mode selection. Default mode is SD Card SDIO 0 MIO pins 40-47
- (near R110) DNP
- (near R111) BOOT_MODE[1]
- (near R108) BOOT_MODE[2]
- (near R109) BOOT_MODE[0]
- (near U12) Reset generator with 2.93V threshold. Reset timeout delay is 200ms
- Reset Generator
- (near C68) DNP
- (near R113) DNP
- Zynq Target Quad SPI1
- BOOT_MODE[0]
- BOOT_MODE[1]
- BOOT_MODE[2]
- BOOT_MODE[3]
- BOOT_MODE[4]
- PLL Enabled
- JTAG Cascade Mode
- (SCL)
- (UART_0)
- (I2C_1)
- (SDA)
- BOOT Source Pins not swappable!
- (MOSI)
- (SPI1)
- (SCK)
- (MISO)
- (I2C_0)
- Title:
- ++CONFIDENTIAL++
- Datum:
- Blatt:
- von:
- Zeit:
- Entwickler:
- Der transparenteste Entwicklungsdienstleister
  der Elektronik- und Softwareentwicklung
- The  information  contained  in  these  documents  is  confidential,  privileged  and  only  for  the
  information of the intended recipient and may
  not be used, published or redistributed without
  the prior written consent from PCB Arts GmbH.
- Revision:
- Checked:
- https://pcb-arts.com/
- mail@pcb-arts.com
- (in symbol CAP_0201_10nF_25V) 0201; X7R
- (in symbol CAP_0201_470nF_10V) 0201; X5R
- (in symbol RES_0201_1.8k_1%) 0201
- (in symbol RES_0201_4.7k_1%) 0201
- (in symbol RES_0201_10k_1%) 0201
- (in symbol RES_0201_33R_1%) 0201
- (in symbol RES_0201_OPT) 0201
- (in symbol XC7Z007S-1CLG400C_Processors - Application Specialised, part D) VCCO_MIO0 1.8V - 3.3V; MULTIUSE IO; VCCO_MIO1 1.8V - 3.3V

### Library data of the parts
C67 C69 C70 = CAP_0201_470nF_10V: as C39-C46 on sheet 10_DDR3 RAM; Manufacturer 2: TDK
C68 = CAP_0201_10nF_25V: Multilayer Ceramic Capacitors MLCC - SMD/SMT 0201 25VDC; Manufacturer 1: Murata Electronics; Manufacturer 1 Prt. Nr.: GRM033C81E103KE14D; Manufacturer 2 Prt. Nr.: 02013C103KAT2A; Manufacturer 2: AVX
OSC1 = SIT8008AI_Clock Oscillators 33.33333MHz: Standard Clock Oscillators 33.33333MHz 2.5V 50ppm -40C +85C; Manufacturer 1: SiTime; Manufacturer 1 Prt. Nr.: SIT8008AI-73-25E-33.333330G
R105 R106 = RES_0201_4.7k_1%: as R103 on sheet 10_DDR3 RAM; Manufacturer 2: Vishay / Dale
R107 = RES_0201_33R_1%: as R118 on sheet 12_QSPI SD-Card; Manufacturer 2: Vishay / Dale
R108 R109 R112 R116 R117 = RES_0201_10k_1%: as R119-R123 on sheet 12_QSPI SD-Card; Manufacturer 2: Vishay / Dale
R110 R113 = RES_0201_1.8k_1%: as R125 on sheet 12_QSPI SD-Card; Manufacturer 2: Vishay / Dale
R111 R114 R115 = RES_0201_OPT: Thick Film Resistors - SMD Optinal
U9 = XC7Z007S-1CLG400C_Processors - Application Specialised: Manufacturer 1: Xilinx; Manufacturer 1 Prt. Nr.: XC7Z007S-1CLG400C
U12 = ADM8611N293ACBZ-R7_Supervisory Circuits IC: Supervisory Circuits IC, Reset Only ULP Supervisory Circuit; Manufacturer 1: Analog Devices; Manufacturer 1 Prt. Nr.: ADM8611N293ACBZ-R7

## Sheet 13_Zynq PL.SchDoc
size A3; SheetNumber: 13; SheetTotal: 14
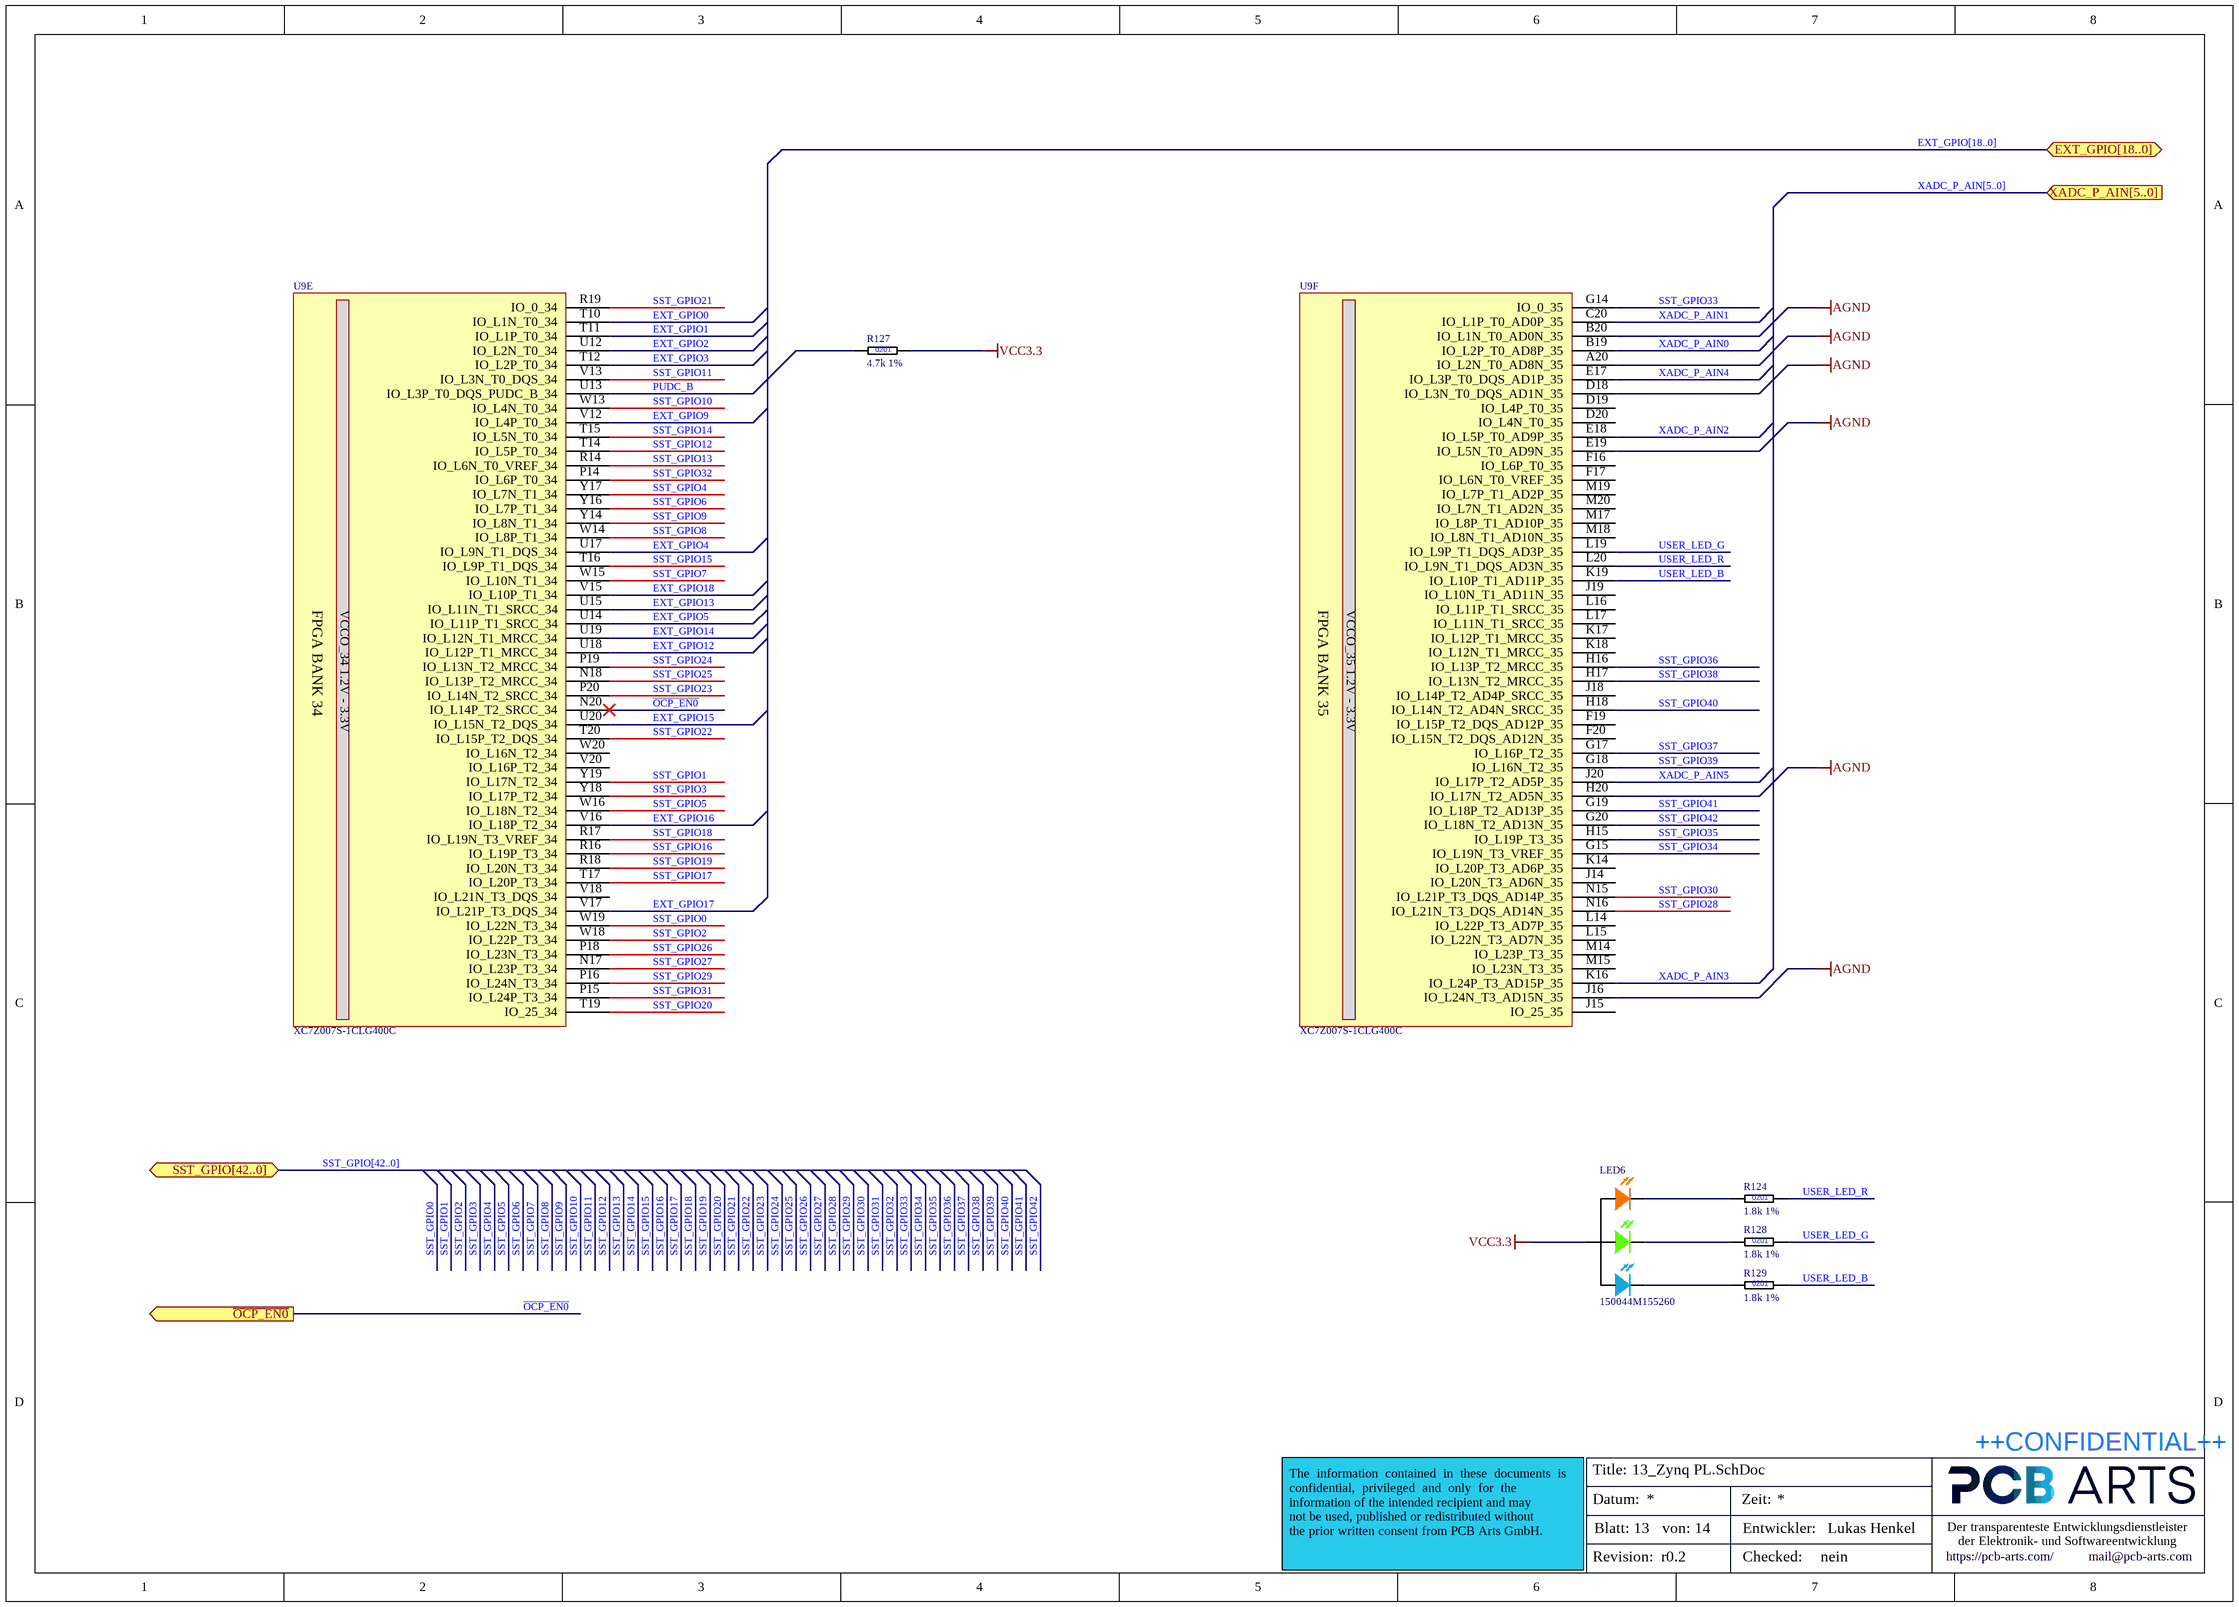
[diagram p13: 13_Zynq PL.SchDoc]

### Parts
LED6  150044M155260  [WL-SFCC SMT]
R124  1.8k 1%  [RESC0603X03L]
R127  4.7k 1%  [RESC0603X03L]
R128  1.8k 1%  [RESC0603X03L]
R129  1.8k 1%  [RESC0603X03L]
U9  XC7Z007S-1CLG400C  [BGA400C80P20X20_1700X1700X160]  (parts E,F of 8)

### Ports
EXT_GPIO[18..0] (bidir), SST_GPIO[42..0] (bidir), XADC_P_AIN[5..0] (in), ~{OCP_EN0} (out)

### Nets
AGND: U9.A20(IO_L2N_T0_AD8N_35) U9.B20(IO_L1N_T0_AD0N_35) U9.D18(IO_L3N_T0_DQS_AD1N_35) U9.E19(IO_L5N_T0_AD9N_35) U9.H20(IO_L17N_T2_AD5N_35) U9.J16(IO_L24N_T3_AD15N_35)
VCC3.3: LED6.1 R127.2
EXT_GPIO0: U9.T10(IO_L1N_T0_34)
EXT_GPIO1: U9.T11(IO_L1P_T0_34)
EXT_GPIO2: U9.U12(IO_L2N_T0_34)
EXT_GPIO3: U9.T12(IO_L2P_T0_34)
EXT_GPIO4: U9.U17(IO_L9N_T1_DQS_34)
EXT_GPIO5: U9.U14(IO_L11P_T1_SRCC_34)
EXT_GPIO9: U9.V12(IO_L4P_T0_34)
EXT_GPIO12: U9.U18(IO_L12P_T1_MRCC_34)
EXT_GPIO13: U9.U15(IO_L11N_T1_SRCC_34)
EXT_GPIO14: U9.U19(IO_L12N_T1_MRCC_34)
EXT_GPIO15: U9.U20(IO_L15N_T2_DQS_34)
EXT_GPIO16: U9.V16(IO_L18P_T2_34)
EXT_GPIO17: U9.V17(IO_L21P_T3_DQS_34)
EXT_GPIO18: U9.V15(IO_L10P_T1_34)
~{OCP_EN0}: U9.N20(IO_L14P_T2_SRCC_34) ; port ~{OCP_EN0}
PUDC_B: R127.1 U9.U13(IO_L3P_T0_DQS_PUDC_B_34)
SST_GPIO0: U9.W19(IO_L22N_T3_34)
SST_GPIO1: U9.Y19(IO_L17N_T2_34)
SST_GPIO2: U9.W18(IO_L22P_T3_34)
SST_GPIO3: U9.Y18(IO_L17P_T2_34)
SST_GPIO4: U9.Y17(IO_L7N_T1_34)
SST_GPIO5: U9.W16(IO_L18N_T2_34)
SST_GPIO6: U9.Y16(IO_L7P_T1_34)
SST_GPIO7: U9.W15(IO_L10N_T1_34)
SST_GPIO8: U9.W14(IO_L8P_T1_34)
SST_GPIO9: U9.Y14(IO_L8N_T1_34)
SST_GPIO10: U9.W13(IO_L4N_T0_34)
SST_GPIO11: U9.V13(IO_L3N_T0_DQS_34)
SST_GPIO12: U9.T14(IO_L5P_T0_34)
SST_GPIO13: U9.R14(IO_L6N_T0_VREF_34)
SST_GPIO14: U9.T15(IO_L5N_T0_34)
SST_GPIO15: U9.T16(IO_L9P_T1_DQS_34)
SST_GPIO16: U9.R16(IO_L19P_T3_34)
SST_GPIO17: U9.T17(IO_L20P_T3_34)
SST_GPIO18: U9.R17(IO_L19N_T3_VREF_34)
SST_GPIO19: U9.R18(IO_L20N_T3_34)
SST_GPIO20: U9.T19(IO_25_34)
SST_GPIO21: U9.R19(IO_0_34)
SST_GPIO22: U9.T20(IO_L15P_T2_DQS_34)
SST_GPIO23: U9.P20(IO_L14N_T2_SRCC_34)
SST_GPIO24: U9.P19(IO_L13N_T2_MRCC_34)
SST_GPIO25: U9.N18(IO_L13P_T2_MRCC_34)
SST_GPIO26: U9.P18(IO_L23N_T3_34)
SST_GPIO27: U9.N17(IO_L23P_T3_34)
SST_GPIO28: U9.N16(IO_L21N_T3_DQS_AD14N_35)
SST_GPIO29: U9.P16(IO_L24N_T3_34)
SST_GPIO30: U9.N15(IO_L21P_T3_DQS_AD14P_35)
SST_GPIO31: U9.P15(IO_L24P_T3_34)
SST_GPIO32: U9.P14(IO_L6P_T0_34)
SST_GPIO33: U9.G14(IO_0_35)
SST_GPIO34: U9.G15(IO_L19N_T3_VREF_35)
SST_GPIO35: U9.H15(IO_L19P_T3_35)
SST_GPIO36: U9.H16(IO_L13P_T2_MRCC_35)
SST_GPIO37: U9.G17(IO_L16P_T2_35)
SST_GPIO38: U9.H17(IO_L13N_T2_MRCC_35)
SST_GPIO39: U9.G18(IO_L16N_T2_35)
SST_GPIO40: U9.H18(IO_L14N_T2_AD4N_SRCC_35)
SST_GPIO41: U9.G19(IO_L18P_T2_AD13P_35)
SST_GPIO42: U9.G20(IO_L18N_T2_AD13N_35)
USER_LED_B: R129.2 U9.K19(IO_L10P_T1_AD11P_35)
USER_LED_G: R128.2 U9.L19(IO_L9P_T1_DQS_AD3P_35)
USER_LED_R: R124.2 U9.L20(IO_L9N_T1_DQS_AD3N_35)
XADC_P_AIN0: U9.B19(IO_L2P_T0_AD8P_35)
XADC_P_AIN1: U9.C20(IO_L1P_T0_AD0P_35)
XADC_P_AIN2: U9.E18(IO_L5P_T0_AD9P_35)
XADC_P_AIN3: U9.K16(IO_L24P_T3_AD15P_35)
XADC_P_AIN4: U9.E17(IO_L3P_T0_DQS_AD1P_35)
XADC_P_AIN5: U9.J20(IO_L17P_T2_AD5P_35)
NetLED6_2: LED6.2 R124.1
NetLED6_3: LED6.3 R128.1
NetLED6_4: LED6.4 R129.1

Not connected (* = marked no-connect by the designer): U9 D19(IO_L4P_T0_35) D20(IO_L4N_T0_35) F16(IO_L6P_T0_35) F17(IO_L6N_T0_VREF_35) F19(IO_L15P_T2_DQS_AD12P_35) F20(IO_L15N_T2_DQS_AD12N_35) J14(IO_L20N_T3_AD6N_35) J15(IO_25_35) J18(IO_L14P_T2_AD4P_SRCC_35) J19(IO_L10N_T1_AD11N_35) K14(IO_L20P_T3_AD6P_35) K17(IO_L12P_T1_MRCC_35) K18(IO_L12N_T1_MRCC_35) L14(IO_L22P_T3_AD7P_35) L15(IO_L22N_T3_AD7N_35) L16(IO_L11P_T1_SRCC_35) L17(IO_L11N_T1_SRCC_35) M14(IO_L23P_T3_35) M15(IO_L23N_T3_35) M17(IO_L8P_T1_AD10P_35) M18(IO_L8N_T1_AD10N_35) M19(IO_L7P_T1_AD2P_35) M20(IO_L7N_T1_AD2N_35) V18(IO_L21N_T3_DQS_34) V20(IO_L16P_T2_34) W20(IO_L16N_T2_34)

### Buses and harness runs
bus EXT_GPIO[18..0] = port EXT_GPIO[18..0]
bus SST_GPIO[42..0] = port SST_GPIO[42..0]
bus XADC_P_AIN[5..0] = port XADC_P_AIN[5..0]

### Notes on the sheet
- Title:
- ++CONFIDENTIAL++
- Datum:
- Blatt:
- von:
- Zeit:
- Entwickler:
- Der transparenteste Entwicklungsdienstleister
  der Elektronik- und Softwareentwicklung
- The  information  contained  in  these  documents  is  confidential,  privileged  and  only  for  the
  information of the intended recipient and may
  not be used, published or redistributed without
  the prior written consent from PCB Arts GmbH.
- Revision:
- Checked:
- https://pcb-arts.com/
- mail@pcb-arts.com
- (in symbol RES_0201_1.8k_1%) 0201
- (in symbol RES_0201_4.7k_1%) 0201
- (in symbol XC7Z007S-1CLG400C_Processors - Application Specialised, part E) FPGA BANK 34; VCCO_34 1.2V - 3.3V
- (in symbol XC7Z007S-1CLG400C_Processors - Application Specialised, part F) FPGA BANK 35; VCCO_35 1.2V - 3.3V

### Library data of the parts
LED6 = 150044M155260_SMD WL-SFCC SMT LED Full-color Chip: Standard LEDs - SMD WL-SFCC SMT LED Full-color Chip; Manufacturer 1: Würth Elektronik; Manufacturer 1 Prt. Nr.: 150044M155260
R124 R128 R129 = RES_0201_1.8k_1%: as R125 on sheet 12_QSPI SD-Card; Manufacturer 2: Vishay / Dale
R127 = RES_0201_4.7k_1%: as R103 on sheet 10_DDR3 RAM; Manufacturer 2: Vishay / Dale
U9 = XC7Z007S-1CLG400C_Processors - Application Specialised: Manufacturer 1: Xilinx; Manufacturer 1 Prt. Nr.: XC7Z007S-1CLG400C

## Sheet 14_Zynq Power.SchDoc
size A3; SheetNumber: 14; SheetTotal: 14
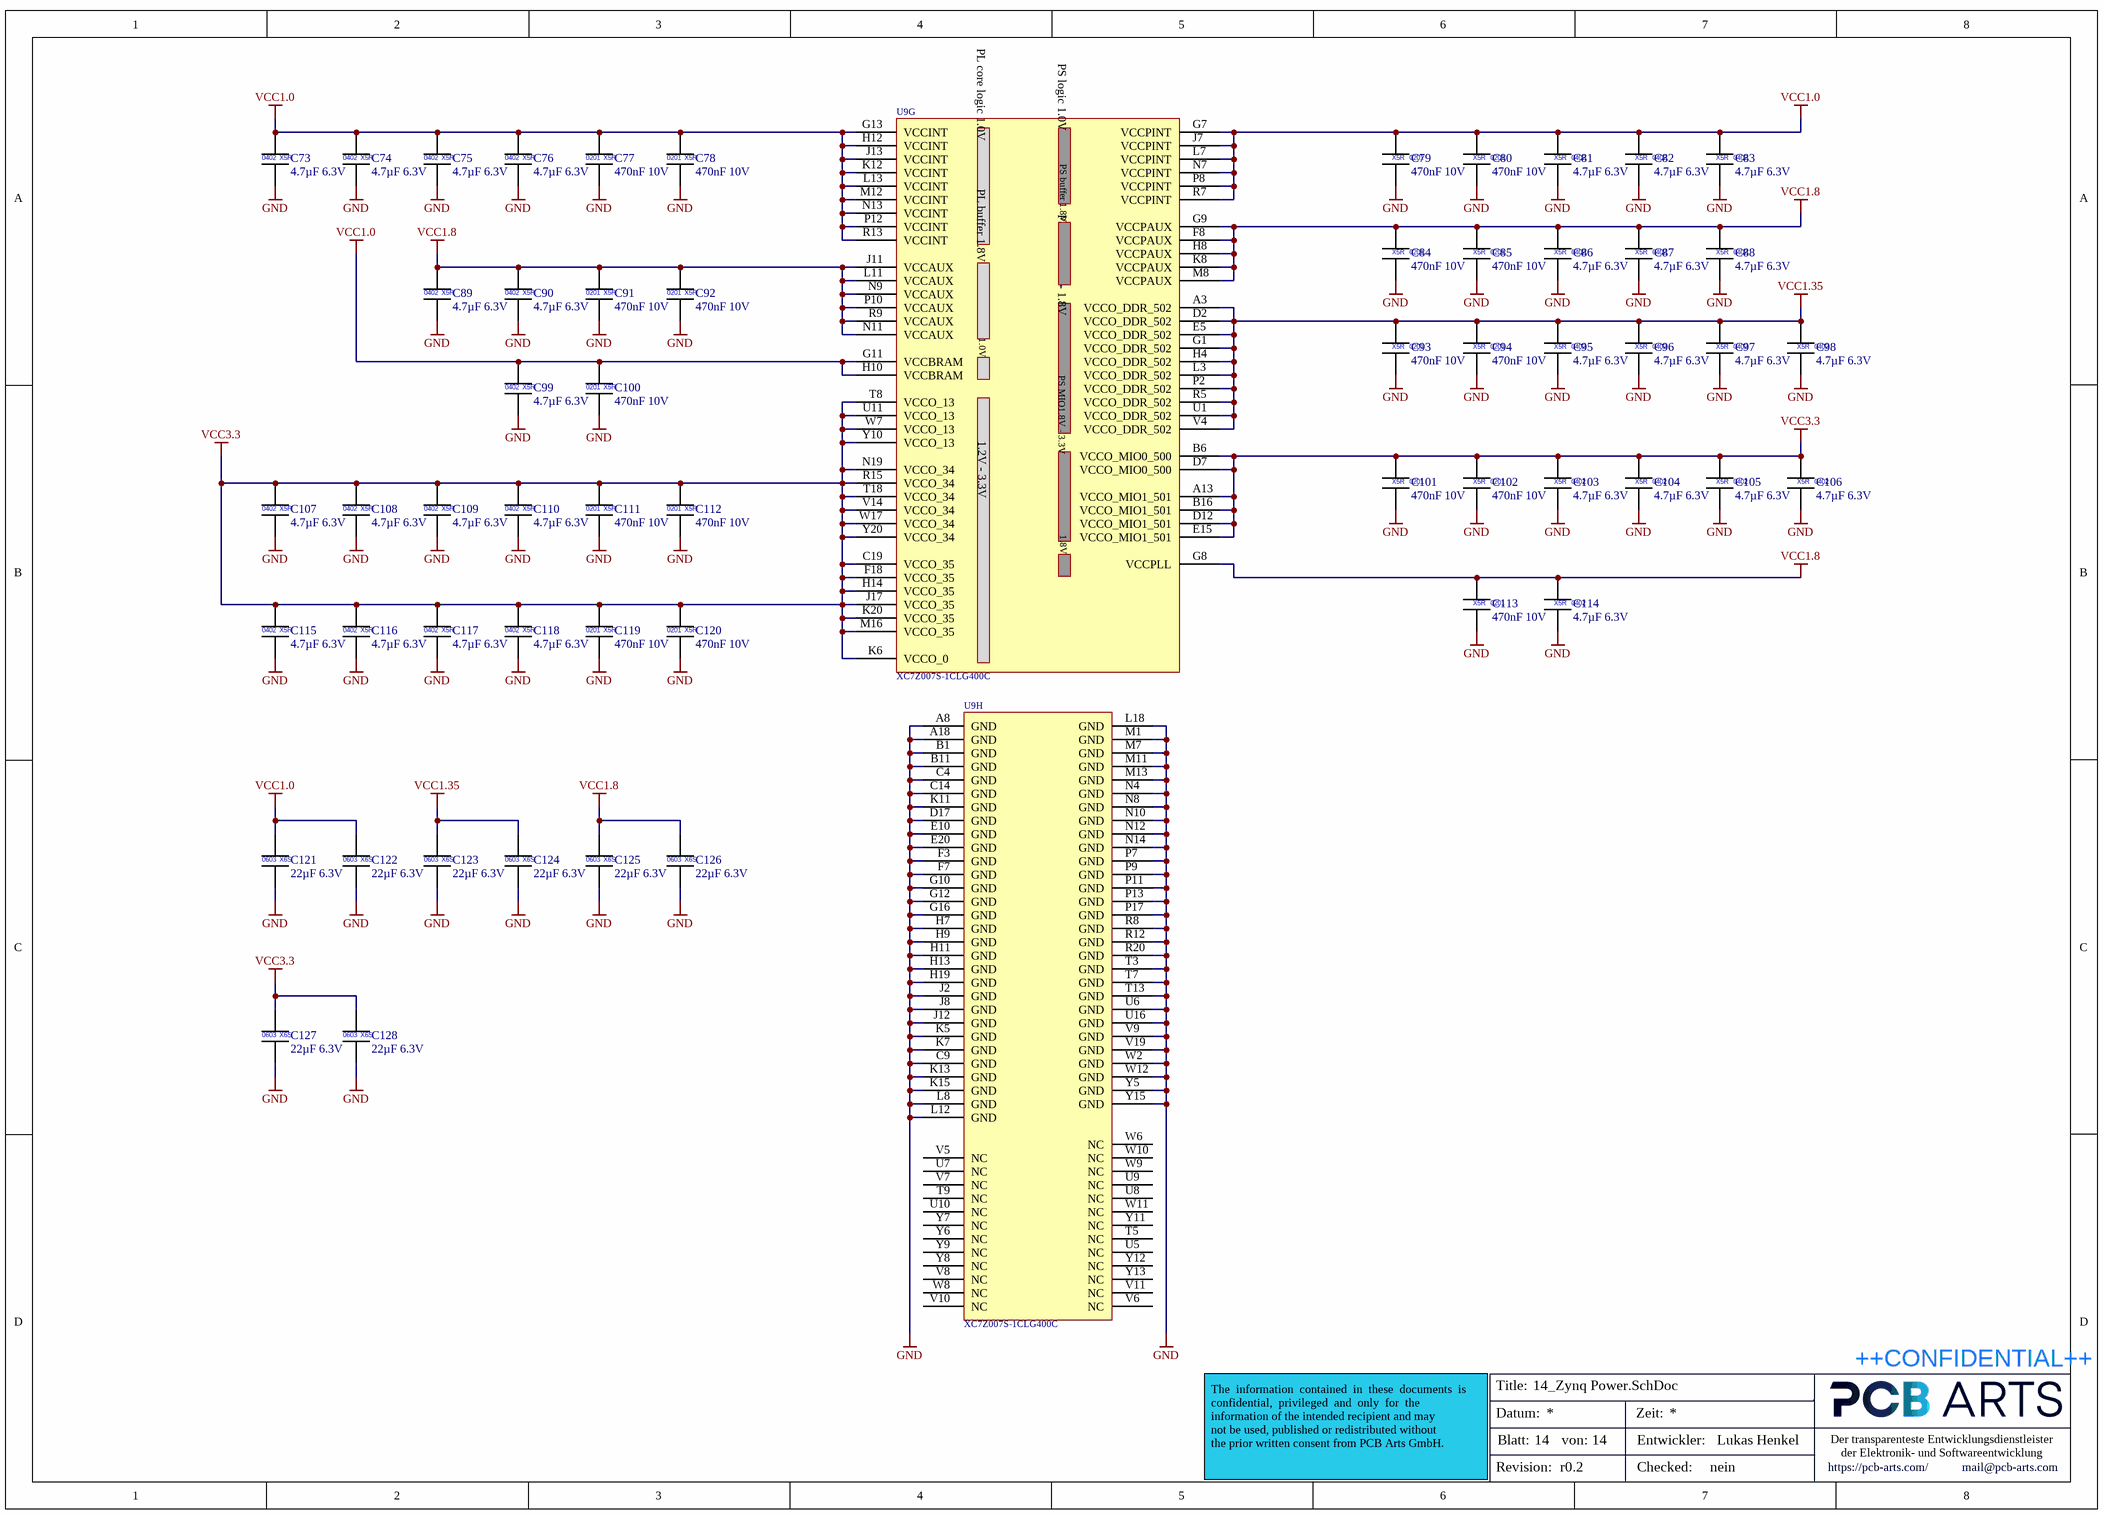
[diagram p14: 14_Zynq Power.SchDoc]

### Parts
C73  4.7µF 6.3V  [CAPC1005X06L]
C74  4.7µF 6.3V  [CAPC1005X06L]
C75  4.7µF 6.3V  [CAPC1005X06L]
C76  4.7µF 6.3V  [CAPC1005X06L]
C77  470nF 10V  [CAPC0603X03L]
C78  470nF 10V  [CAPC0603X03L]
C79  470nF 10V  [CAPC0603X03L]
C80  470nF 10V  [CAPC0603X03L]
C81  4.7µF 6.3V  [CAPC1005X06L]
C82  4.7µF 6.3V  [CAPC1005X06L]
C83  4.7µF 6.3V  [CAPC1005X06L]
C84  470nF 10V  [CAPC0603X03L]
C85  470nF 10V  [CAPC0603X03L]
C86  4.7µF 6.3V  [CAPC1005X06L]
C87  4.7µF 6.3V  [CAPC1005X06L]
C88  4.7µF 6.3V  [CAPC1005X06L]
C89  4.7µF 6.3V  [CAPC1005X06L]
C90  4.7µF 6.3V  [CAPC1005X06L]
C91  470nF 10V  [CAPC0603X03L]
C92  470nF 10V  [CAPC0603X03L]
C93  470nF 10V  [CAPC0603X03L]
C94  470nF 10V  [CAPC0603X03L]
C95  4.7µF 6.3V  [CAPC1005X06L]
C96  4.7µF 6.3V  [CAPC1005X06L]
C97  4.7µF 6.3V  [CAPC1005X06L]
C98  4.7µF 6.3V  [CAPC1005X06L]
C99  4.7µF 6.3V  [CAPC1005X06L]
C100  470nF 10V  [CAPC0603X03L]
C101  470nF 10V  [CAPC0603X03L]
C102  470nF 10V  [CAPC0603X03L]
C103  4.7µF 6.3V  [CAPC1005X06L]
C104  4.7µF 6.3V  [CAPC1005X06L]
C105  4.7µF 6.3V  [CAPC1005X06L]
C106  4.7µF 6.3V  [CAPC1005X06L]
C107  4.7µF 6.3V  [CAPC1005X06L]
C108  4.7µF 6.3V  [CAPC1005X06L]
C109  4.7µF 6.3V  [CAPC1005X06L]
C110  4.7µF 6.3V  [CAPC1005X06L]
C111  470nF 10V  [CAPC0603X03L]
C112  470nF 10V  [CAPC0603X03L]
C113  470nF 10V  [CAPC0603X03L]
C114  4.7µF 6.3V  [CAPC1005X06L]
C115  4.7µF 6.3V  [CAPC1005X06L]
C116  4.7µF 6.3V  [CAPC1005X06L]
C117  4.7µF 6.3V  [CAPC1005X06L]
C118  4.7µF 6.3V  [CAPC1005X06L]
C119  470nF 10V  [CAPC0603X03L]
C120  470nF 10V  [CAPC0603X03L]
C121  22µF 6.3V  [CAPC1608X10L]
C122  22µF 6.3V  [CAPC1608X10L]
C123  22µF 6.3V  [CAPC1608X10L]
C124  22µF 6.3V  [CAPC1608X10L]
C125  22µF 6.3V  [CAPC1608X10L]
C126  22µF 6.3V  [CAPC1608X10L]
C127  22µF 6.3V  [CAPC1608X10L]
C128  22µF 6.3V  [CAPC1608X10L]
U9  XC7Z007S-1CLG400C  [BGA400C80P20X20_1700X1700X160]  (parts G,H of 8)

### Nets
GND: C73.2 C74.2 C75.2 C76.2 C77.2 C78.2 C79.2 C80.2 C81.2 C82.2 C83.2 C84.2 C85.2 C86.2 C87.2 C88.2 C89.2 C90.2 C91.2 C92.2 C93.2 C94.2 C95.2 C96.2 C97.2 C98.2 C99.2 C100.2 C101.2 C102.2 C103.2 C104.2 C105.2 C106.2 C107.2 C108.2 C109.2 C110.2 C111.2 C112.2 C113.2 C114.2 C115.2 C116.2 C117.2 C118.2 C119.2 C120.2 C121.2 C122.2 C123.2 C124.2 C125.2 C126.2 C127.2 C128.2 U9.A8(GND) U9.A18(GND) U9.B1(GND) U9.B11(GND) U9.C4(GND) U9.C9(GND) U9.C14(GND) U9.D17(GND) U9.E10(GND) U9.E20(GND) U9.F3(GND) U9.F7(GND) U9.G10(GND) U9.G12(GND) U9.G16(GND) U9.H7(GND) U9.H9(GND) U9.H11(GND) U9.H13(GND) U9.H19(GND) U9.J2(GND) U9.J8(GND) U9.J12(GND) U9.K5(GND) U9.K7(GND) U9.K11(GND) U9.K13(GND) U9.K15(GND) U9.L8(GND) U9.L12(GND) U9.L18(GND) U9.M1(GND) U9.M7(GND) U9.M11(GND) U9.M13(GND) U9.N4(GND) U9.N8(GND) U9.N10(GND) U9.N12(GND) U9.N14(GND) U9.P7(GND) U9.P9(GND) U9.P11(GND) U9.P13(GND) U9.P17(GND) U9.R8(GND) U9.R12(GND) U9.R20(GND) U9.T3(GND) U9.T7(GND) U9.T13(GND) U9.U6(GND) U9.U16(GND) U9.V9(GND) U9.V19(GND) U9.W2(GND) U9.W12(GND) U9.Y5(GND) U9.Y15(GND)
VCC1.0: C73.1 C74.1 C75.1 C76.1 C77.1 C78.1 C79.1 C80.1 C81.1 C82.1 C83.1 C99.1 C100.1 C121.1 C122.1 U9.G7(VCCPINT) U9.G11(VCCBRAM) U9.G13(VCCINT) U9.H10(VCCBRAM) U9.H12(VCCINT) U9.J7(VCCPINT) U9.J13(VCCINT) U9.K12(VCCINT) U9.L7(VCCPINT) U9.L13(VCCINT) U9.M12(VCCINT) U9.N7(VCCPINT) U9.N13(VCCINT) U9.P8(VCCPINT) U9.P12(VCCINT) U9.R7(VCCPINT) U9.R13(VCCINT)
VCC1.8: C84.1 C85.1 C86.1 C87.1 C88.1 C89.1 C90.1 C91.1 C92.1 C113.1 C114.1 C125.1 C126.1 U9.F8(VCCPAUX) U9.G8(VCCPLL) U9.G9(VCCPAUX) U9.H8(VCCPAUX) U9.J11(VCCAUX) U9.K8(VCCPAUX) U9.L11(VCCAUX) U9.M8(VCCPAUX) U9.N9(VCCAUX) U9.N11(VCCAUX) U9.P10(VCCAUX) U9.R9(VCCAUX)
VCC1.35: C93.1 C94.1 C95.1 C96.1 C97.1 C98.1 C123.1 C124.1 U9.A3(VCCO_DDR_502) U9.D2(VCCO_DDR_502) U9.E5(VCCO_DDR_502) U9.G1(VCCO_DDR_502) U9.H4(VCCO_DDR_502) U9.L3(VCCO_DDR_502) U9.P2(VCCO_DDR_502) U9.R5(VCCO_DDR_502) U9.U1(VCCO_DDR_502) U9.V4(VCCO_DDR_502)
VCC3.3: C101.1 C102.1 C103.1 C104.1 C105.1 C106.1 C107.1 C108.1 C109.1 C110.1 C111.1 C112.1 C115.1 C116.1 C117.1 C118.1 C119.1 C120.1 C127.1 C128.1 U9.A13(VCCO_MIO1_501) U9.B6(VCCO_MIO0_500) U9.B16(VCCO_MIO1_501) U9.C19(VCCO_35) U9.D7(VCCO_MIO0_500) U9.D12(VCCO_MIO1_501) U9.E15(VCCO_MIO1_501) U9.F18(VCCO_35) U9.H14(VCCO_35) U9.J17(VCCO_35) U9.K6(VCCO_0) U9.K20(VCCO_35) U9.M16(VCCO_35) U9.N19(VCCO_34) U9.R15(VCCO_34) U9.T8(VCCO_13) U9.T18(VCCO_34) U9.U11(VCCO_13) U9.V14(VCCO_34) U9.W7(VCCO_13) U9.W17(VCCO_34) U9.Y10(VCCO_13) U9.Y20(VCCO_34)

Not connected (* = marked no-connect by the designer): U9 T5(NC) T9(NC) U5(NC) U7(NC) U8(NC) U9(NC) U10(NC) V5(NC) V6(NC) V7(NC) V8(NC) V10(NC) V11(NC) W6(NC) W8(NC) W9(NC) W10(NC) W11(NC) Y6(NC) Y7(NC) Y8(NC) Y9(NC) Y11(NC) Y12(NC) Y13(NC)

### Notes on the sheet
- Title:
- ++CONFIDENTIAL++
- Datum:
- Blatt:
- von:
- Zeit:
- Entwickler:
- Der transparenteste Entwicklungsdienstleister
  der Elektronik- und Softwareentwicklung
- The  information  contained  in  these  documents  is  confidential,  privileged  and  only  for  the
  information of the intended recipient and may
  not be used, published or redistributed without
  the prior written consent from PCB Arts GmbH.
- Revision:
- Checked:
- https://pcb-arts.com/
- mail@pcb-arts.com
- (in symbol CAP_0201_470nF_10V) 0201; X5R
- (in symbol CAP_0402_4.7µ_6.3V) 0402; X5R
- (in symbol CAP_0603_22µ_6.3V) 0603; X6S
- (in symbol XC7Z007S-1CLG400C_Processors - Application Specialised, part G) PS logic 1.0V; PL core logic 1.0V; PS buffer 1.8V; PL buffer 1.8V; PS DDR 1.2V - 1.8V; 1.0V; PS MIO1.8V - 3.3V; 1.2V - 3.3V; 1.8V

### Library data of the parts
C73-C76 C81-C83 C86-C90 C95-C99 C103-C110 C114-C118 = CAP_0402_4.7µ_6.3V: as C47 on sheet 10_DDR3 RAM; Manufacturer 2: Taiyo Yuden
C77-C80 C84 C85 C91-C94 C100-C102 C111-C113 C119 C120 = CAP_0201_470nF_10V: as C39-C46 on sheet 10_DDR3 RAM; Manufacturer 2: TDK
C121-C128 = CAP_0603_22µ_6.3V: Multilayer Ceramic Capacitors MLCC - SMD/SMT 0603 6.3VDC; Manufacturer 1: Yageo; Manufacturer 1 Prt. Nr.: CC0603MRX6S5BB226; Manufacturer 2 Prt. Nr.: GRM188C80J226ME15D; Manufacturer 2: Murata Electronics
U9 = XC7Z007S-1CLG400C_Processors - Application Specialised: Manufacturer 1: Xilinx; Manufacturer 1 Prt. Nr.: XC7Z007S-1CLG400C

## Nets that join several sheets
AGND: 07_Analog Buffer (14 pins), 08_Zynq Config_ADC (U9.J10 U9.K10 U9.L9), 13_Zynq PL (6 pins)
GND: 02_Input Connectors (14 pins), 03_Battery Management (7 pins), 04_Supply Monitoring (60 pins), 05_Output Connectors (14 pins), 06_USB-UART Bridge (5 pins), 07_Analog Buffer (L7.1), 08_Zynq Config_ADC (LED4.1 U9.F10), 09_Zynq DDR (C38.2 R97.1), 10_DDR3 RAM (71 pins), 12_QSPI SD-Card (6 pins), 11_Zynq MIO (13 pins), 14_Zynq Power (115 pins)
VCC1.0: 04_Supply Monitoring (C22.1 R31.2 R34.2 U4.A2), 05_Output Connectors (J6.3 J7.1 J7.4), 14_Zynq Power (32 pins)
VCC1.8: 04_Supply Monitoring (C13.1 R22.2 R24.2 U4.C1), 05_Output Connectors (J8.3 J8.5), 08_Zynq Config_ADC (L8.1 U9.F11), 14_Zynq Power (25 pins)
VCC1.35: 04_Supply Monitoring (9 pins), 05_Output Connectors (J8.12 J8.14), 09_Zynq DDR (R98.1), 10_DDR3 RAM (60 pins), 14_Zynq Power (18 pins)
VCC3.3: 02_Input Connectors (J3.1), 03_Battery Management (5 pins), 04_Supply Monitoring (17 pins), 05_Output Connectors (11 pins), 06_USB-UART Bridge (9 pins), 07_Analog Buffer (L6.1), 08_Zynq Config_ADC (6 pins), 12_QSPI SD-Card (10 pins), 11_Zynq MIO (11 pins), 13_Zynq PL (LED6.1 R127.2), 14_Zynq Power (43 pins)
VSYS: 03_Battery Management (7 pins), 04_Supply Monitoring (24 pins)
VTT: 04_Supply Monitoring (C129.1 U14.3 U14.5), 10_DDR3 RAM (24 pins)
VTTREF: 04_Supply Monitoring (C64.1 U14.6), 09_Zynq DDR (C38.1 U9.H6 U9.P6), 10_DDR3 RAM (6 pins)
AP_IO1: 03_Battery Management (R12.2), 11_Zynq MIO (U9.A16)
AP_IO2: 03_Battery Management (R13.2), 11_Zynq MIO (U9.B18)
AP_IO3: 03_Battery Management (R14.2), 11_Zynq MIO (U9.A17)
CHG_SCL: 03_Battery Management (R9.1 U1.A4), 04_Supply Monitoring (U4.C4 U6.C4), 11_Zynq MIO (U9.A19)
CHG_SDA: 03_Battery Management (R8.1 U1.A3), 04_Supply Monitoring (U4.D4 U6.D4), 11_Zynq MIO (U9.E14)
DDR3_A0: 09_Zynq DDR (U9.N2), 10_DDR3 RAM (R71.2 U10.N3 U11.N3)
DDR3_A1: 09_Zynq DDR (U9.K2), 10_DDR3 RAM (R73.2 U10.P7 U11.P7)
DDR3_A2: 09_Zynq DDR (U9.M3), 10_DDR3 RAM (R75.2 U10.P3 U11.P3)
DDR3_A3: 09_Zynq DDR (U9.K3), 10_DDR3 RAM (R77.2 U10.N2 U11.N2)
DDR3_A4: 09_Zynq DDR (U9.M4), 10_DDR3 RAM (R79.2 U10.P8 U11.P8)
DDR3_A5: 09_Zynq DDR (U9.L1), 10_DDR3 RAM (R81.2 U10.P2 U11.P2)
DDR3_A6: 09_Zynq DDR (U9.L4), 10_DDR3 RAM (R83.2 U10.R8 U11.R8)
DDR3_A7: 09_Zynq DDR (U9.K4), 10_DDR3 RAM (R85.2 U10.R2 U11.R2)
DDR3_A8: 09_Zynq DDR (U9.K1), 10_DDR3 RAM (R87.2 U10.T8 U11.T8)
DDR3_A9: 09_Zynq DDR (U9.J4), 10_DDR3 RAM (R89.2 U10.R3 U11.R3)
DDR3_A10: 09_Zynq DDR (U9.F5), 10_DDR3 RAM (R91.2 U10.L7 U11.L7)
DDR3_A11: 09_Zynq DDR (U9.G4), 10_DDR3 RAM (R93.2 U10.R7 U11.R7)
DDR3_A12: 09_Zynq DDR (U9.E4), 10_DDR3 RAM (R72.2 U10.N7 U11.N7)
DDR3_A13: 09_Zynq DDR (U9.D4), 10_DDR3 RAM (R74.2 U10.T3 U11.T3)
DDR3_A14: 09_Zynq DDR (U9.F4), 10_DDR3 RAM (R76.2 U10.T7 U11.T7)
DDR3_BA0: 09_Zynq DDR (U9.L5), 10_DDR3 RAM (R80.2 U10.M2 U11.M2)
DDR3_BA1: 09_Zynq DDR (U9.R4), 10_DDR3 RAM (R82.2 U10.N8 U11.N8)
DDR3_BA2: 09_Zynq DDR (U9.J5), 10_DDR3 RAM (R84.2 U10.M3 U11.M3)
DDR3_CAS: 09_Zynq DDR (U9.P5), 10_DDR3 RAM (R88.2 U10.K3 U11.K3)
DDR3_CKE: 09_Zynq DDR (U9.N3), 10_DDR3 RAM (R78.2 U10.K9 U11.K9)
DDR3_CLK_N: 09_Zynq DDR (U9.M2), 10_DDR3 RAM (R101.1 U10.K7 U11.K7)
DDR3_CLK_P: 09_Zynq DDR (U9.L2), 10_DDR3 RAM (R101.2 U10.J7 U11.J7)
DDR3_CS: 09_Zynq DDR (U9.N1), 10_DDR3 RAM (R92.2 U10.L2 U11.L2)
DDR3_DM0: 09_Zynq DDR (U9.Y1), 10_DDR3 RAM (U10.E7)
DDR3_DM1: 09_Zynq DDR (U9.F1), 10_DDR3 RAM (U10.D3)
DDR3_DM2: 09_Zynq DDR (U9.T1), 10_DDR3 RAM (U11.E7)
DDR3_DM3: 09_Zynq DDR (U9.A1), 10_DDR3 RAM (U11.D3)
DDR3_DQ0: 09_Zynq DDR (U9.V2), 10_DDR3 RAM (U10.E3)
DDR3_DQ1: 09_Zynq DDR (U9.W3), 10_DDR3 RAM (U10.F7)
DDR3_DQ2: 09_Zynq DDR (U9.V1), 10_DDR3 RAM (U10.F2)
DDR3_DQ3: 09_Zynq DDR (U9.Y3), 10_DDR3 RAM (U10.F8)
DDR3_DQ4: 09_Zynq DDR (U9.Y2), 10_DDR3 RAM (U10.H3)
DDR3_DQ5: 09_Zynq DDR (U9.Y4), 10_DDR3 RAM (U10.H8)
DDR3_DQ6: 09_Zynq DDR (U9.W1), 10_DDR3 RAM (U10.G2)
DDR3_DQ7: 09_Zynq DDR (U9.V3), 10_DDR3 RAM (U10.H7)
DDR3_DQ8: 09_Zynq DDR (U9.G3), 10_DDR3 RAM (U10.D7)
DDR3_DQ9: 09_Zynq DDR (U9.H2), 10_DDR3 RAM (U10.C3)
DDR3_DQ10: 09_Zynq DDR (U9.E2), 10_DDR3 RAM (U10.C8)
DDR3_DQ11: 09_Zynq DDR (U9.J1), 10_DDR3 RAM (U10.C2)
DDR3_DQ12: 09_Zynq DDR (U9.H1), 10_DDR3 RAM (U10.A7)
DDR3_DQ13: 09_Zynq DDR (U9.J3), 10_DDR3 RAM (U10.A2)
DDR3_DQ14: 09_Zynq DDR (U9.E3), 10_DDR3 RAM (U10.B8)
DDR3_DQ15: 09_Zynq DDR (U9.H3), 10_DDR3 RAM (U10.A3)
DDR3_DQ16: 09_Zynq DDR (U9.R1), 10_DDR3 RAM (U11.E3)
DDR3_DQ17: 09_Zynq DDR (U9.T4), 10_DDR3 RAM (U11.F7)
DDR3_DQ18: 09_Zynq DDR (U9.P3), 10_DDR3 RAM (U11.F2)
DDR3_DQ19: 09_Zynq DDR (U9.U3), 10_DDR3 RAM (U11.F8)
DDR3_DQ20: 09_Zynq DDR (U9.R3), 10_DDR3 RAM (U11.H3)
DDR3_DQ21: 09_Zynq DDR (U9.U4), 10_DDR3 RAM (U11.H8)
DDR3_DQ22: 09_Zynq DDR (U9.P1), 10_DDR3 RAM (U11.G2)
DDR3_DQ23: 09_Zynq DDR (U9.U2), 10_DDR3 RAM (U11.H7)
DDR3_DQ24: 09_Zynq DDR (U9.D1), 10_DDR3 RAM (U11.D7)
DDR3_DQ25: 09_Zynq DDR (U9.A2), 10_DDR3 RAM (U11.C3)
DDR3_DQ26: 09_Zynq DDR (U9.D3), 10_DDR3 RAM (U11.C8)
DDR3_DQ27: 09_Zynq DDR (U9.C1), 10_DDR3 RAM (U11.C2)
DDR3_DQ28: 09_Zynq DDR (U9.C3), 10_DDR3 RAM (U11.A7)
DDR3_DQ29: 09_Zynq DDR (U9.A4), 10_DDR3 RAM (U11.A2)
DDR3_DQ30: 09_Zynq DDR (U9.E1), 10_DDR3 RAM (U11.B8)
DDR3_DQ31: 09_Zynq DDR (U9.B3), 10_DDR3 RAM (U11.A3)
DDR3_DQS0_N: 09_Zynq DDR (U9.W4), 10_DDR3 RAM (U10.G3)
DDR3_DQS0_P: 09_Zynq DDR (U9.W5), 10_DDR3 RAM (U10.F3)
DDR3_DQS1_N: 09_Zynq DDR (U9.F2), 10_DDR3 RAM (U10.B7)
DDR3_DQS1_P: 09_Zynq DDR (U9.G2), 10_DDR3 RAM (U10.C7)
DDR3_DQS2_N: 09_Zynq DDR (U9.T2), 10_DDR3 RAM (U11.G3)
DDR3_DQS2_P: 09_Zynq DDR (U9.R2), 10_DDR3 RAM (U11.F3)
DDR3_DQS3_N: 09_Zynq DDR (U9.B2), 10_DDR3 RAM (U11.B7)
DDR3_DQS3_P: 09_Zynq DDR (U9.C2), 10_DDR3 RAM (U11.C7)
DDR3_DRST: 09_Zynq DDR (U9.B4), 10_DDR3 RAM (R103.2 U10.T2 U11.T2)
DDR3_ODT: 09_Zynq DDR (U9.N5), 10_DDR3 RAM (R94.2 U10.K1 U11.K1)
DDR3_RAS: 09_Zynq DDR (U9.P4), 10_DDR3 RAM (R86.2 U10.J3 U11.J3)
DDR3_WE: 09_Zynq DDR (U9.M5), 10_DDR3 RAM (R90.2 U10.L3 U11.L3)
EN_VCC1.0: 04_Supply Monitoring (R33.1 U7.A2), 05_Output Connectors (J4.27)
EXT_AIN0: 05_Output Connectors (J4.5 R38.2), 07_Analog Buffer (R52.1)
EXT_AIN1: 05_Output Connectors (J4.6 R39.2), 07_Analog Buffer (R55.1)
EXT_AIN2: 05_Output Connectors (J4.7 R40.2), 07_Analog Buffer (R58.1)
EXT_AIN3: 05_Output Connectors (J4.8 R41.2), 07_Analog Buffer (R61.1)
EXT_AIN4: 05_Output Connectors (J4.9 R42.2), 07_Analog Buffer (R64.1)
EXT_AIN5: 05_Output Connectors (J4.10 R43.2), 07_Analog Buffer (R67.1)
EXT_GPIO0: 05_Output Connectors (J4.19), 13_Zynq PL (U9.T10)
EXT_GPIO1: 05_Output Connectors (J4.20), 13_Zynq PL (U9.T11)
EXT_GPIO2: 05_Output Connectors (J4.21), 13_Zynq PL (U9.U12)
EXT_GPIO3: 05_Output Connectors (J4.16), 13_Zynq PL (U9.T12)
EXT_GPIO4: 05_Output Connectors (J4.25), 13_Zynq PL (U9.U17)
EXT_GPIO5: 05_Output Connectors (J4.23), 13_Zynq PL (U9.U14)
EXT_GPIO6: 05_Output Connectors (J4.11 J8.22), 11_Zynq MIO (U9.B12)
EXT_GPIO7: 05_Output Connectors (J4.12 J8.24), 11_Zynq MIO (U9.D16)
EXT_GPIO8: 05_Output Connectors (J4.13 J8.26), 11_Zynq MIO (U9.B14)
EXT_GPIO9: 05_Output Connectors (J4.22), 13_Zynq PL (U9.V12)
EXT_GPIO10: 05_Output Connectors (J4.17 J8.18), 11_Zynq MIO (U9.B9)
EXT_GPIO11: 05_Output Connectors (J4.18 J8.16), 11_Zynq MIO (U9.B13)
EXT_GPIO12: 05_Output Connectors (R38.1), 13_Zynq PL (U9.U18)
EXT_GPIO13: 05_Output Connectors (J4.24), 13_Zynq PL (U9.U15)
EXT_GPIO14: 05_Output Connectors (R39.1), 13_Zynq PL (U9.U19)
EXT_GPIO15: 05_Output Connectors (R40.1), 13_Zynq PL (U9.U20)
EXT_GPIO16: 05_Output Connectors (R42.1), 13_Zynq PL (U9.V16)
EXT_GPIO17: 05_Output Connectors (R43.1), 13_Zynq PL (U9.V17)
EXT_GPIO18: 05_Output Connectors (R41.1), 13_Zynq PL (U9.V15)
EXT_~{RESET}_IN: 05_Output Connectors (J4.1), 11_Zynq MIO (C69.1 U12.C1)
JTAG_TCK_T: 02_Input Connectors (R6.2), 08_Zynq Config_ADC (U9.F9)
JTAG_TDI: 02_Input Connectors (J3.8), 08_Zynq Config_ADC (U9.G6)
JTAG_TDO: 02_Input Connectors (J3.6), 08_Zynq Config_ADC (U9.F6)
JTAG_TMS: 02_Input Connectors (J3.2), 08_Zynq Config_ADC (U9.J6)
NetC2_1: 02_Input Connectors (R1.2), 03_Battery Management (7 pins), 04_Supply Monitoring (U6.A1 U6.A2), 05_Output Connectors (R37.2), 06_USB-UART Bridge (R45.2)
NetC23_1: 04_Supply Monitoring (U6.D2), 05_Output Connectors (C23.1 J4.2 R36.2)
NetC24_1: 04_Supply Monitoring (U6.B1), 05_Output Connectors (C24.1 J4.26 R37.1)
NetJ4_28: 03_Battery Management (R16.1 U1.C1 U1.D1 U1.E1), 04_Supply Monitoring (U6.D1), 05_Output Connectors (J4.28)
NetL1_1: 02_Input Connectors (L1.1 R1.1), 04_Supply Monitoring (U6.A3)
~{OCP_EN0}: 03_Battery Management (R99.2), 11_Zynq MIO (U9.A15)
PAC1_~{PWRDN}: 04_Supply Monitoring (U4.B3), 11_Zynq MIO (U9.F14)
PAC1_SLOW/~{ALERT}: 04_Supply Monitoring (R21.1 U4.C3), 11_Zynq MIO (U9.F15)
PAC2_~{PWRDN}: 04_Supply Monitoring (U6.B3), 11_Zynq MIO (U9.D11)
PAC2_SLOW/~{ALERT}: 04_Supply Monitoring (R27.1 U6.C3), 11_Zynq MIO (U9.D10)
~{RESET}: 02_Input Connectors (J3.10), 11_Zynq MIO (R105.1 U9.B10)
SD_CD: 12_QSPI SD-Card (J5.DET R125.2), 11_Zynq MIO (U9.D13)
SD_CLK: 12_QSPI SD-Card (R126.1), 11_Zynq MIO (U9.D14)
SD_CMD: 12_QSPI SD-Card (J5.3 R120.1), 11_Zynq MIO (U9.C17)
SD_DAT0: 12_QSPI SD-Card (J5.7 R121.1), 11_Zynq MIO (U9.E12)
SD_DAT1: 12_QSPI SD-Card (J5.8 R122.1), 11_Zynq MIO (U9.A9)
SD_DAT2: 12_QSPI SD-Card (J5.1 R123.1), 11_Zynq MIO (U9.F13)
SD_DAT3: 12_QSPI SD-Card (J5.2 R119.1), 11_Zynq MIO (U9.B15)
SPI0_CS: 12_QSPI SD-Card (U13.1), 11_Zynq MIO (U9.E6)
SPI0_M0: 12_QSPI SD-Card (U13.5), 11_Zynq MIO (U9.E9)
SPI0_M1: 12_QSPI SD-Card (U13.2), 11_Zynq MIO (U9.C6)
SPI0_M2: 12_QSPI SD-Card (U13.3), 11_Zynq MIO (U9.D9)
SPI0_M3: 12_QSPI SD-Card (U13.7), 11_Zynq MIO (U9.E8)
SPI0_SCK: 12_QSPI SD-Card (R118.1), 11_Zynq MIO (U9.B5)
SST_GPIO0: 05_Output Connectors (J6.28), 13_Zynq PL (U9.W19)
SST_GPIO1: 05_Output Connectors (J6.26), 13_Zynq PL (U9.Y19)
SST_GPIO2: 05_Output Connectors (J6.24), 13_Zynq PL (U9.W18)
SST_GPIO3: 05_Output Connectors (J6.22), 13_Zynq PL (U9.Y18)
SST_GPIO4: 05_Output Connectors (J6.18), 13_Zynq PL (U9.Y17)
SST_GPIO5: 05_Output Connectors (J6.16), 13_Zynq PL (U9.W16)
SST_GPIO6: 05_Output Connectors (J6.14), 13_Zynq PL (U9.Y16)
SST_GPIO7: 05_Output Connectors (J6.12), 13_Zynq PL (U9.W15)
SST_GPIO8: 05_Output Connectors (J6.8), 13_Zynq PL (U9.W14)
SST_GPIO9: 05_Output Connectors (J6.6), 13_Zynq PL (U9.Y14)
SST_GPIO10: 05_Output Connectors (J6.4), 13_Zynq PL (U9.W13)
SST_GPIO11: 05_Output Connectors (J6.2), 13_Zynq PL (U9.V13)
SST_GPIO12: 05_Output Connectors (J6.5), 13_Zynq PL (U9.T14)
SST_GPIO13: 05_Output Connectors (J6.7), 13_Zynq PL (U9.R14)
SST_GPIO14: 05_Output Connectors (J6.9), 13_Zynq PL (U9.T15)
SST_GPIO15: 05_Output Connectors (J6.13), 13_Zynq PL (U9.T16)
SST_GPIO16: 05_Output Connectors (J6.15), 13_Zynq PL (U9.R16)
SST_GPIO17: 05_Output Connectors (J6.17), 13_Zynq PL (U9.T17)
SST_GPIO18: 05_Output Connectors (J6.19), 13_Zynq PL (U9.R17)
SST_GPIO19: 05_Output Connectors (J6.23), 13_Zynq PL (U9.R18)
SST_GPIO20: 05_Output Connectors (J6.25), 13_Zynq PL (U9.T19)
SST_GPIO21: 05_Output Connectors (J6.27), 13_Zynq PL (U9.R19)
SST_GPIO22: 05_Output Connectors (J6.29), 13_Zynq PL (U9.T20)
SST_GPIO23: 05_Output Connectors (J7.30), 13_Zynq PL (U9.P20)
SST_GPIO24: 05_Output Connectors (J7.26), 13_Zynq PL (U9.P19)
SST_GPIO25: 05_Output Connectors (J7.24), 13_Zynq PL (U9.N18)
SST_GPIO26: 05_Output Connectors (J7.22), 13_Zynq PL (U9.P18)
SST_GPIO27: 05_Output Connectors (J7.20), 13_Zynq PL (U9.N17)
SST_GPIO28: 05_Output Connectors (J7.16), 13_Zynq PL (U9.N16)
SST_GPIO29: 05_Output Connectors (J7.14), 13_Zynq PL (U9.P16)
SST_GPIO30: 05_Output Connectors (J7.12), 13_Zynq PL (U9.N15)
SST_GPIO31: 05_Output Connectors (J7.10), 13_Zynq PL (U9.P15)
SST_GPIO32: 05_Output Connectors (J7.6), 13_Zynq PL (U9.P14)
SST_GPIO33: 05_Output Connectors (J7.5), 13_Zynq PL (U9.G14)
SST_GPIO34: 05_Output Connectors (J7.9), 13_Zynq PL (U9.G15)
SST_GPIO35: 05_Output Connectors (J7.11), 13_Zynq PL (U9.H15)
SST_GPIO36: 05_Output Connectors (J7.15), 13_Zynq PL (U9.H16)
SST_GPIO37: 05_Output Connectors (J7.17), 13_Zynq PL (U9.G17)
SST_GPIO38: 05_Output Connectors (J7.19), 13_Zynq PL (U9.H17)
SST_GPIO39: 05_Output Connectors (J7.21), 13_Zynq PL (U9.G18)
SST_GPIO40: 05_Output Connectors (J7.23), 13_Zynq PL (U9.H18)
SST_GPIO41: 05_Output Connectors (J7.25), 13_Zynq PL (U9.G19)
SST_GPIO42: 05_Output Connectors (J7.29), 13_Zynq PL (U9.G20)
UART1_RXD_SST4: 05_Output Connectors (J8.25), 11_Zynq MIO (U9.C11)
UART1_TXD_SST4: 05_Output Connectors (J8.23), 11_Zynq MIO (U9.C10)
UART_RXD: 05_Output Connectors (J4.14), 06_USB-UART Bridge (R47.1 U8.17), 11_Zynq MIO (U9.C8)
UART_TXD: 05_Output Connectors (J4.15), 06_USB-UART Bridge (R46.1 U8.18), 11_Zynq MIO (U9.C5)
ULPI_CLK: 05_Output Connectors (J8.9), 11_Zynq MIO (U9.A11)
ULPI_DATA0: 05_Output Connectors (J8.13), 11_Zynq MIO (U9.A14)
ULPI_DATA1: 05_Output Connectors (J8.19), 11_Zynq MIO (U9.D15)
ULPI_DATA2: 05_Output Connectors (J8.11), 11_Zynq MIO (U9.A12)
ULPI_DATA3: 05_Output Connectors (J8.2), 11_Zynq MIO (U9.F12)
ULPI_DATA4: 05_Output Connectors (J8.7), 11_Zynq MIO (U9.A10)
ULPI_DATA5: 05_Output Connectors (J8.4), 11_Zynq MIO (U9.E13)
ULPI_DATA6: 05_Output Connectors (J8.29), 11_Zynq MIO (U9.C18)
ULPI_DATA7: 05_Output Connectors (J8.27), 11_Zynq MIO (U9.C16)
ULPI_DIR: 05_Output Connectors (J8.6), 11_Zynq MIO (U9.C13)
ULPI_NXT: 05_Output Connectors (J8.10), 11_Zynq MIO (U9.E16)
ULPI_STP: 05_Output Connectors (J8.17), 11_Zynq MIO (U9.C15)
USB_D_N: 02_Input Connectors (D1.A2 D1.C2 R5.2), 06_USB-UART Bridge (U8.5)
USB_D_P: 02_Input Connectors (D1.A1 D1.C1 R4.2), 06_USB-UART Bridge (U8.4)
VBAT: 02_Input Connectors (F1.2), 03_Battery Management (R16.2 U1.D4), 04_Supply Monitoring (U6.C1)
XADC_P_AIN0: 07_Analog Buffer (R50.2 R51.2), 13_Zynq PL (U9.B19)
XADC_P_AIN1: 07_Analog Buffer (R53.2 R54.2), 13_Zynq PL (U9.C20)
XADC_P_AIN2: 07_Analog Buffer (R56.2 R57.2), 13_Zynq PL (U9.E18)
XADC_P_AIN3: 07_Analog Buffer (R59.2 R60.2), 13_Zynq PL (U9.K16)
XADC_P_AIN4: 07_Analog Buffer (R62.2 R63.2), 13_Zynq PL (U9.E17)
XADC_P_AIN5: 07_Analog Buffer (R65.2 R66.2), 13_Zynq PL (U9.J20)